# EasyEDA Pro project zxc_411.eprj

# Schematic Schematic1

## Sheets
1 mcu: Create Date: 2024-07-20; Page Name: mcu; Project Name: zxc_411; Schematic Name: Schematic1; Update Date: 2024-08-27; Company: 嘉立创EDA; Page Size: A4; Version: V1.0
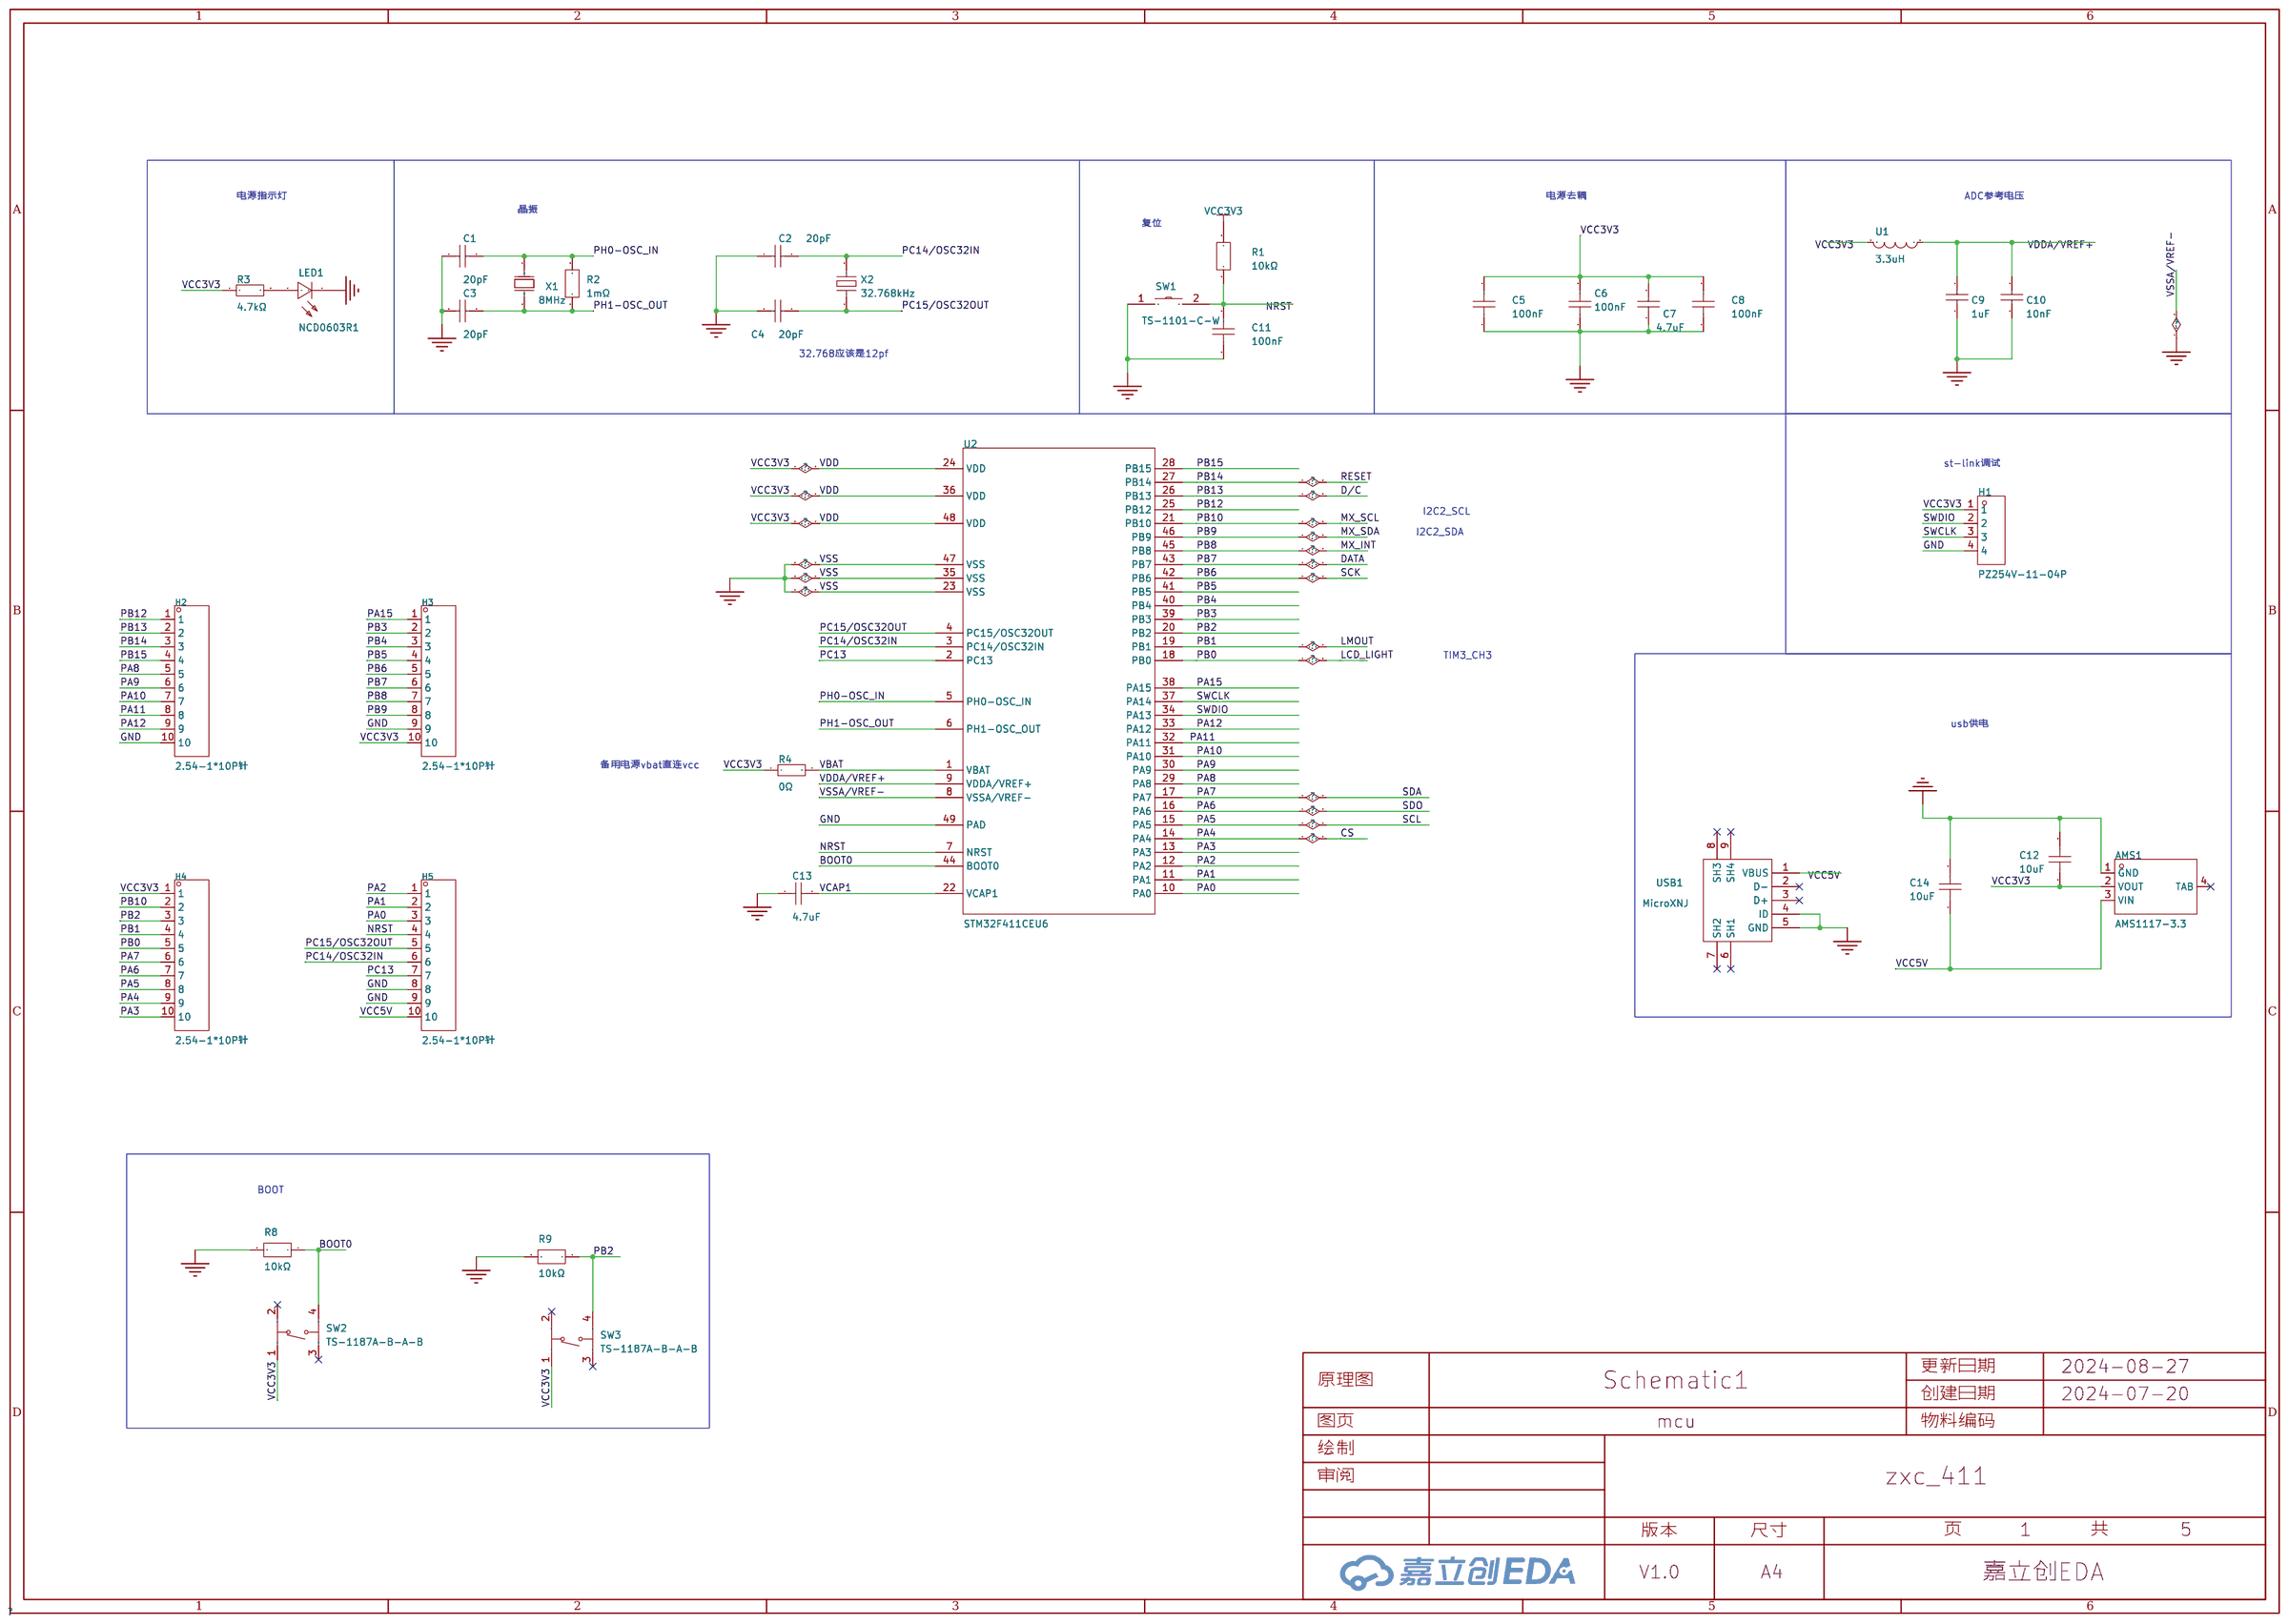
[diagram p0: mcu]
2 lcd: Create Date: 2024-07-21; Page Name: lcd; Update Date: 2024-07-23
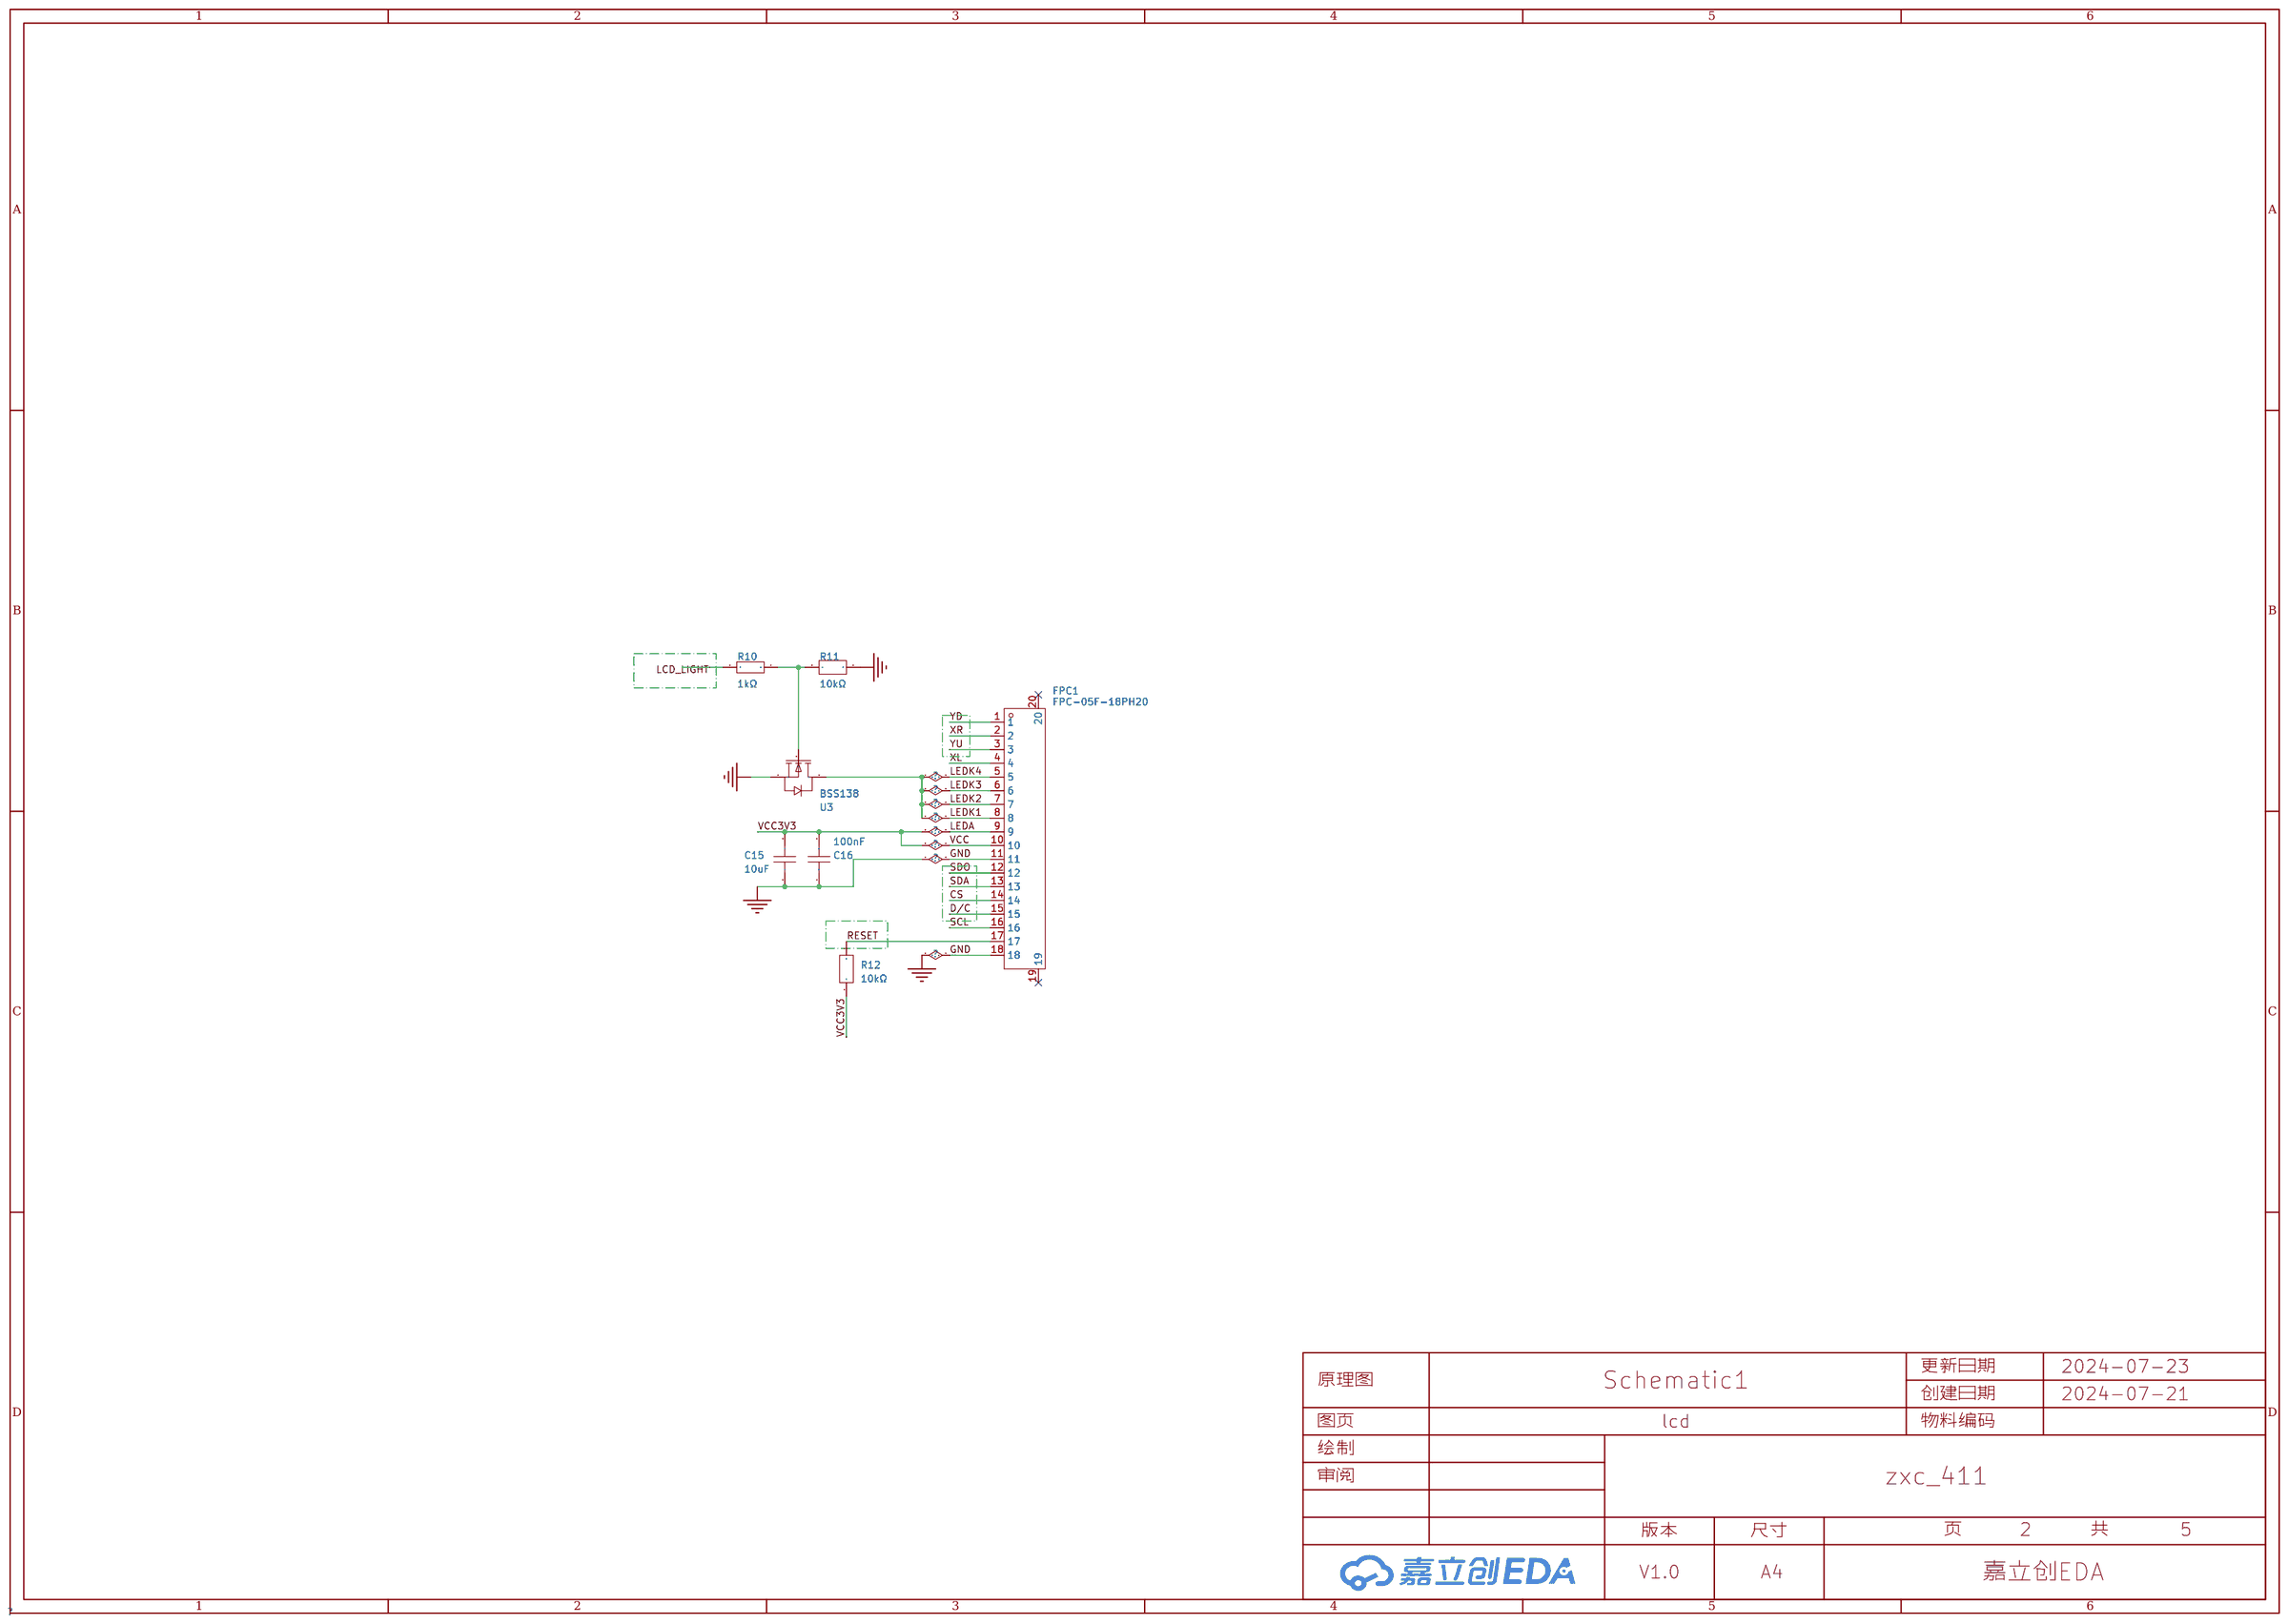
[diagram p1: lcd]
3 htu21d: Create Date: 2024-07-22; Page Name: htu21d; Update Date: 2024-07-23
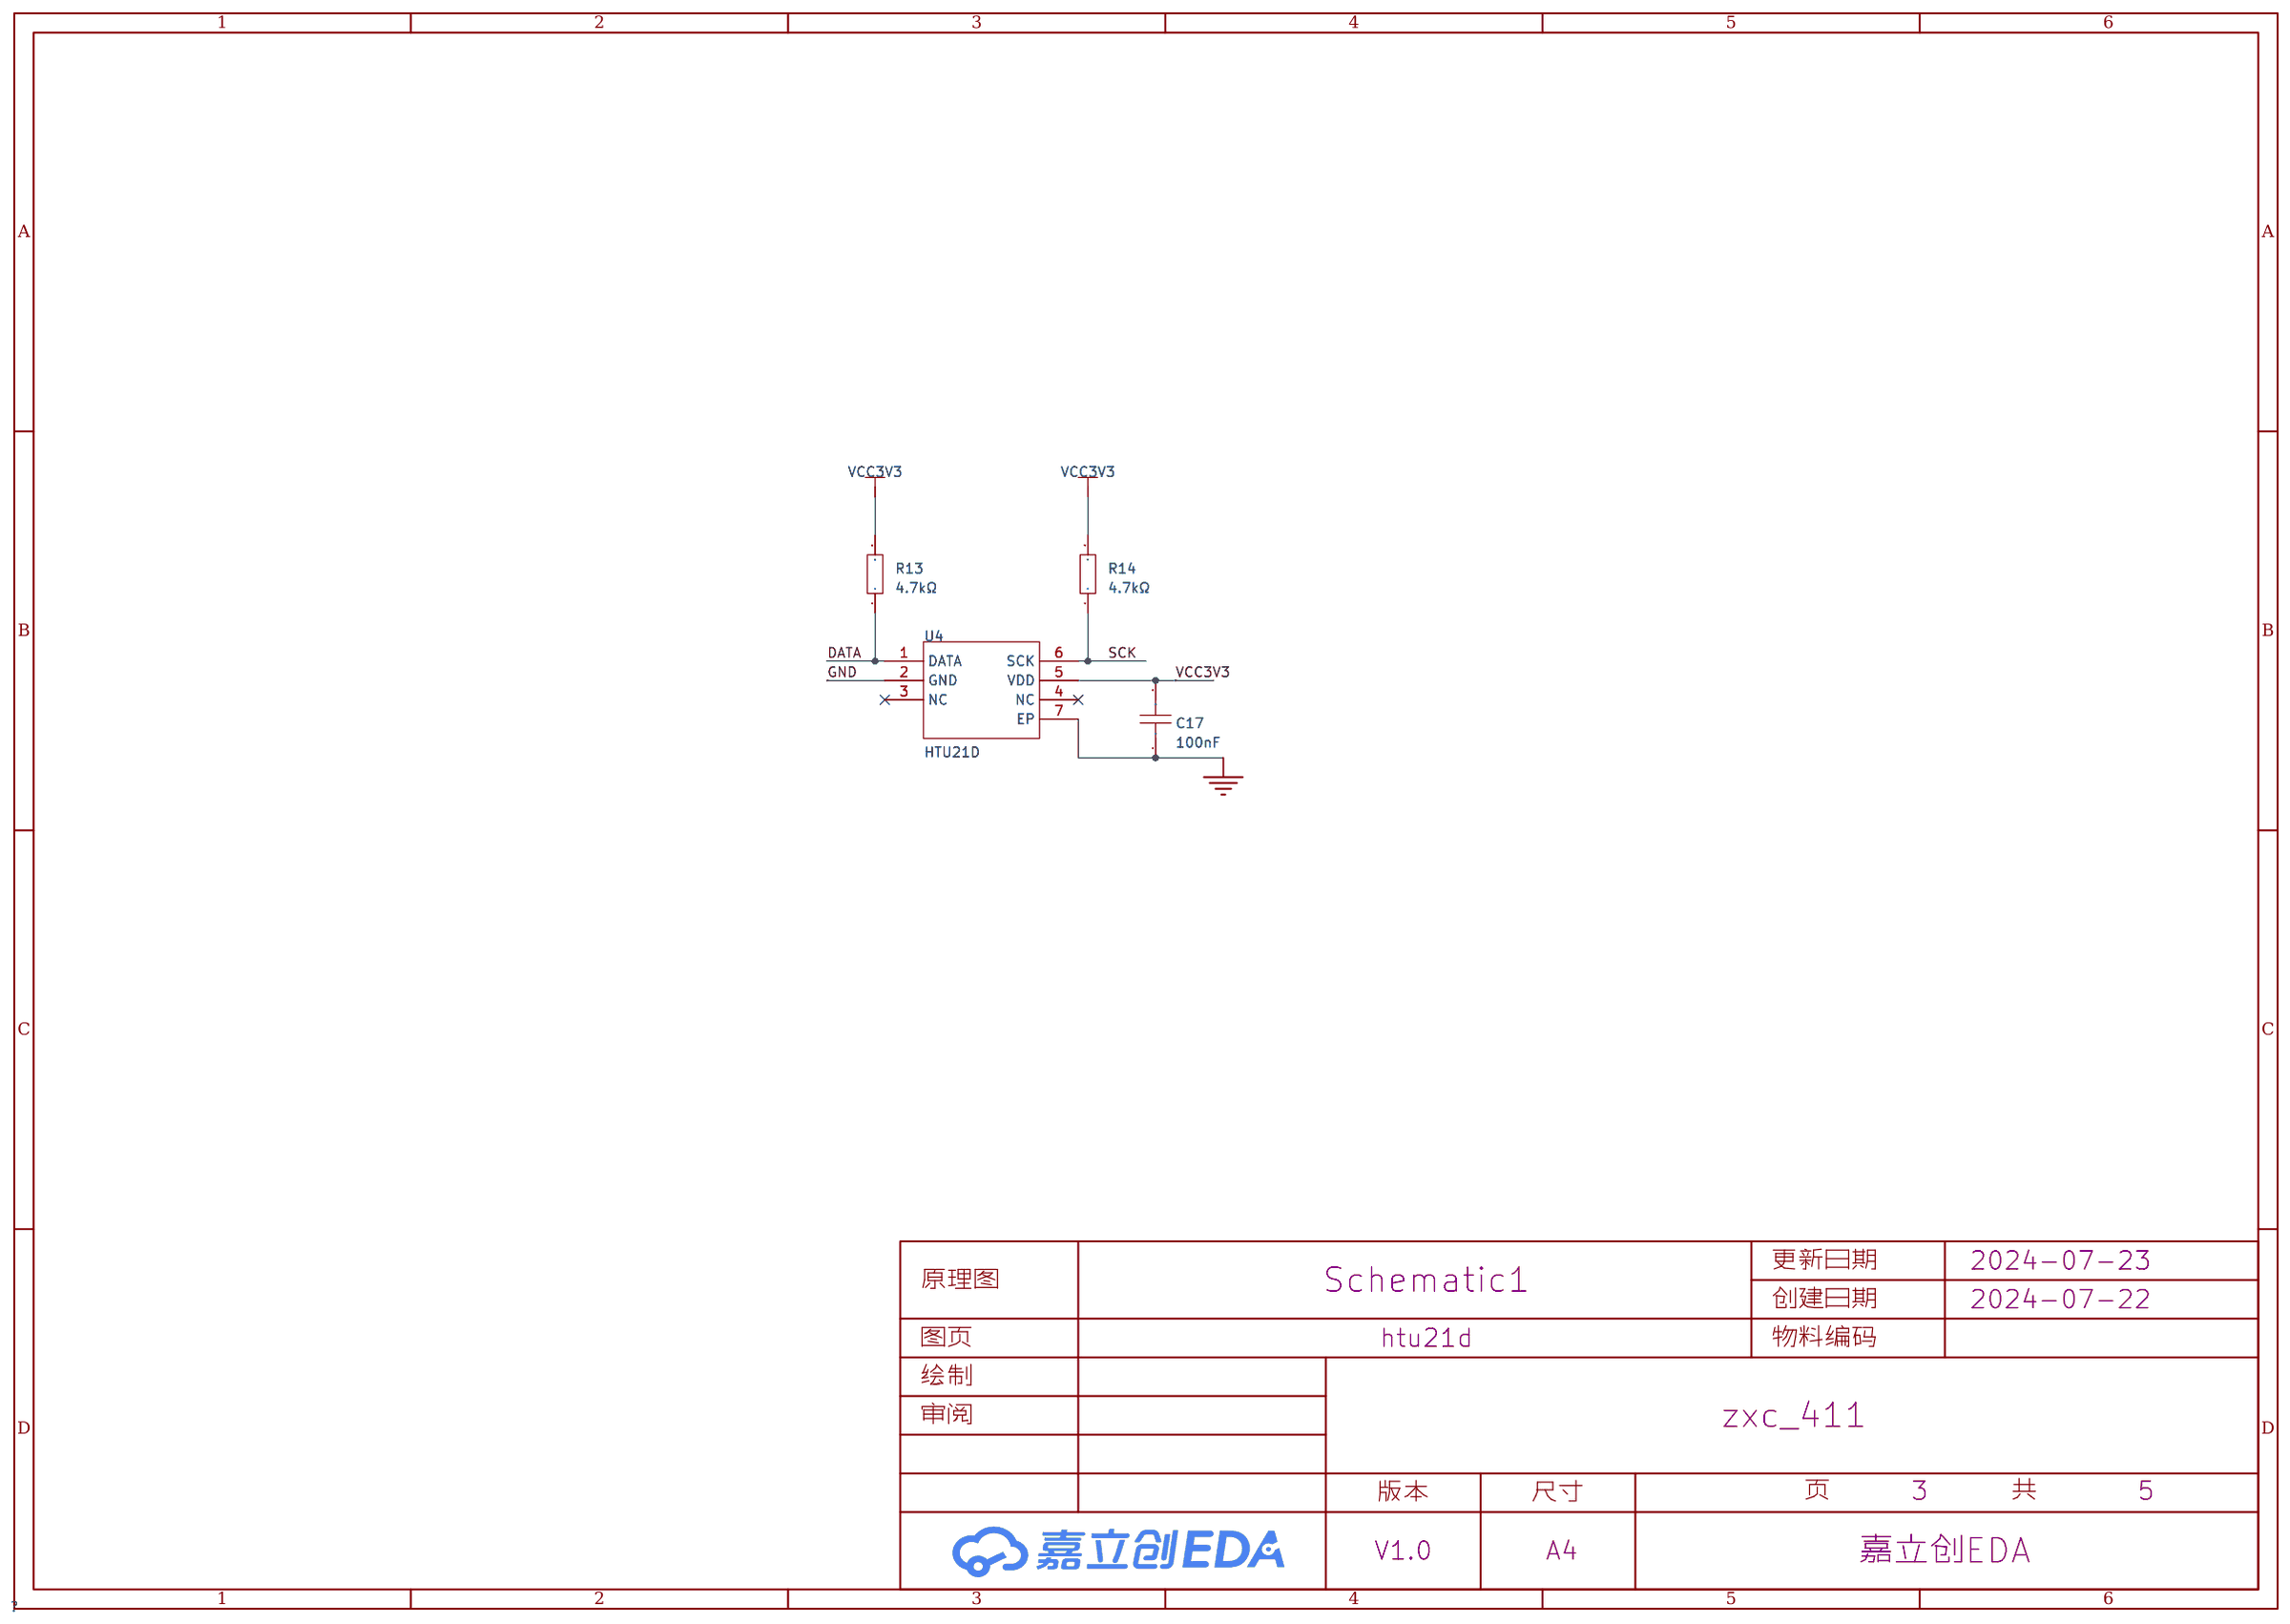
[diagram p2: htu21d]
4 MX: Create Date: 2024-07-22; Page Name: MX; Update Date: 2024-07-23
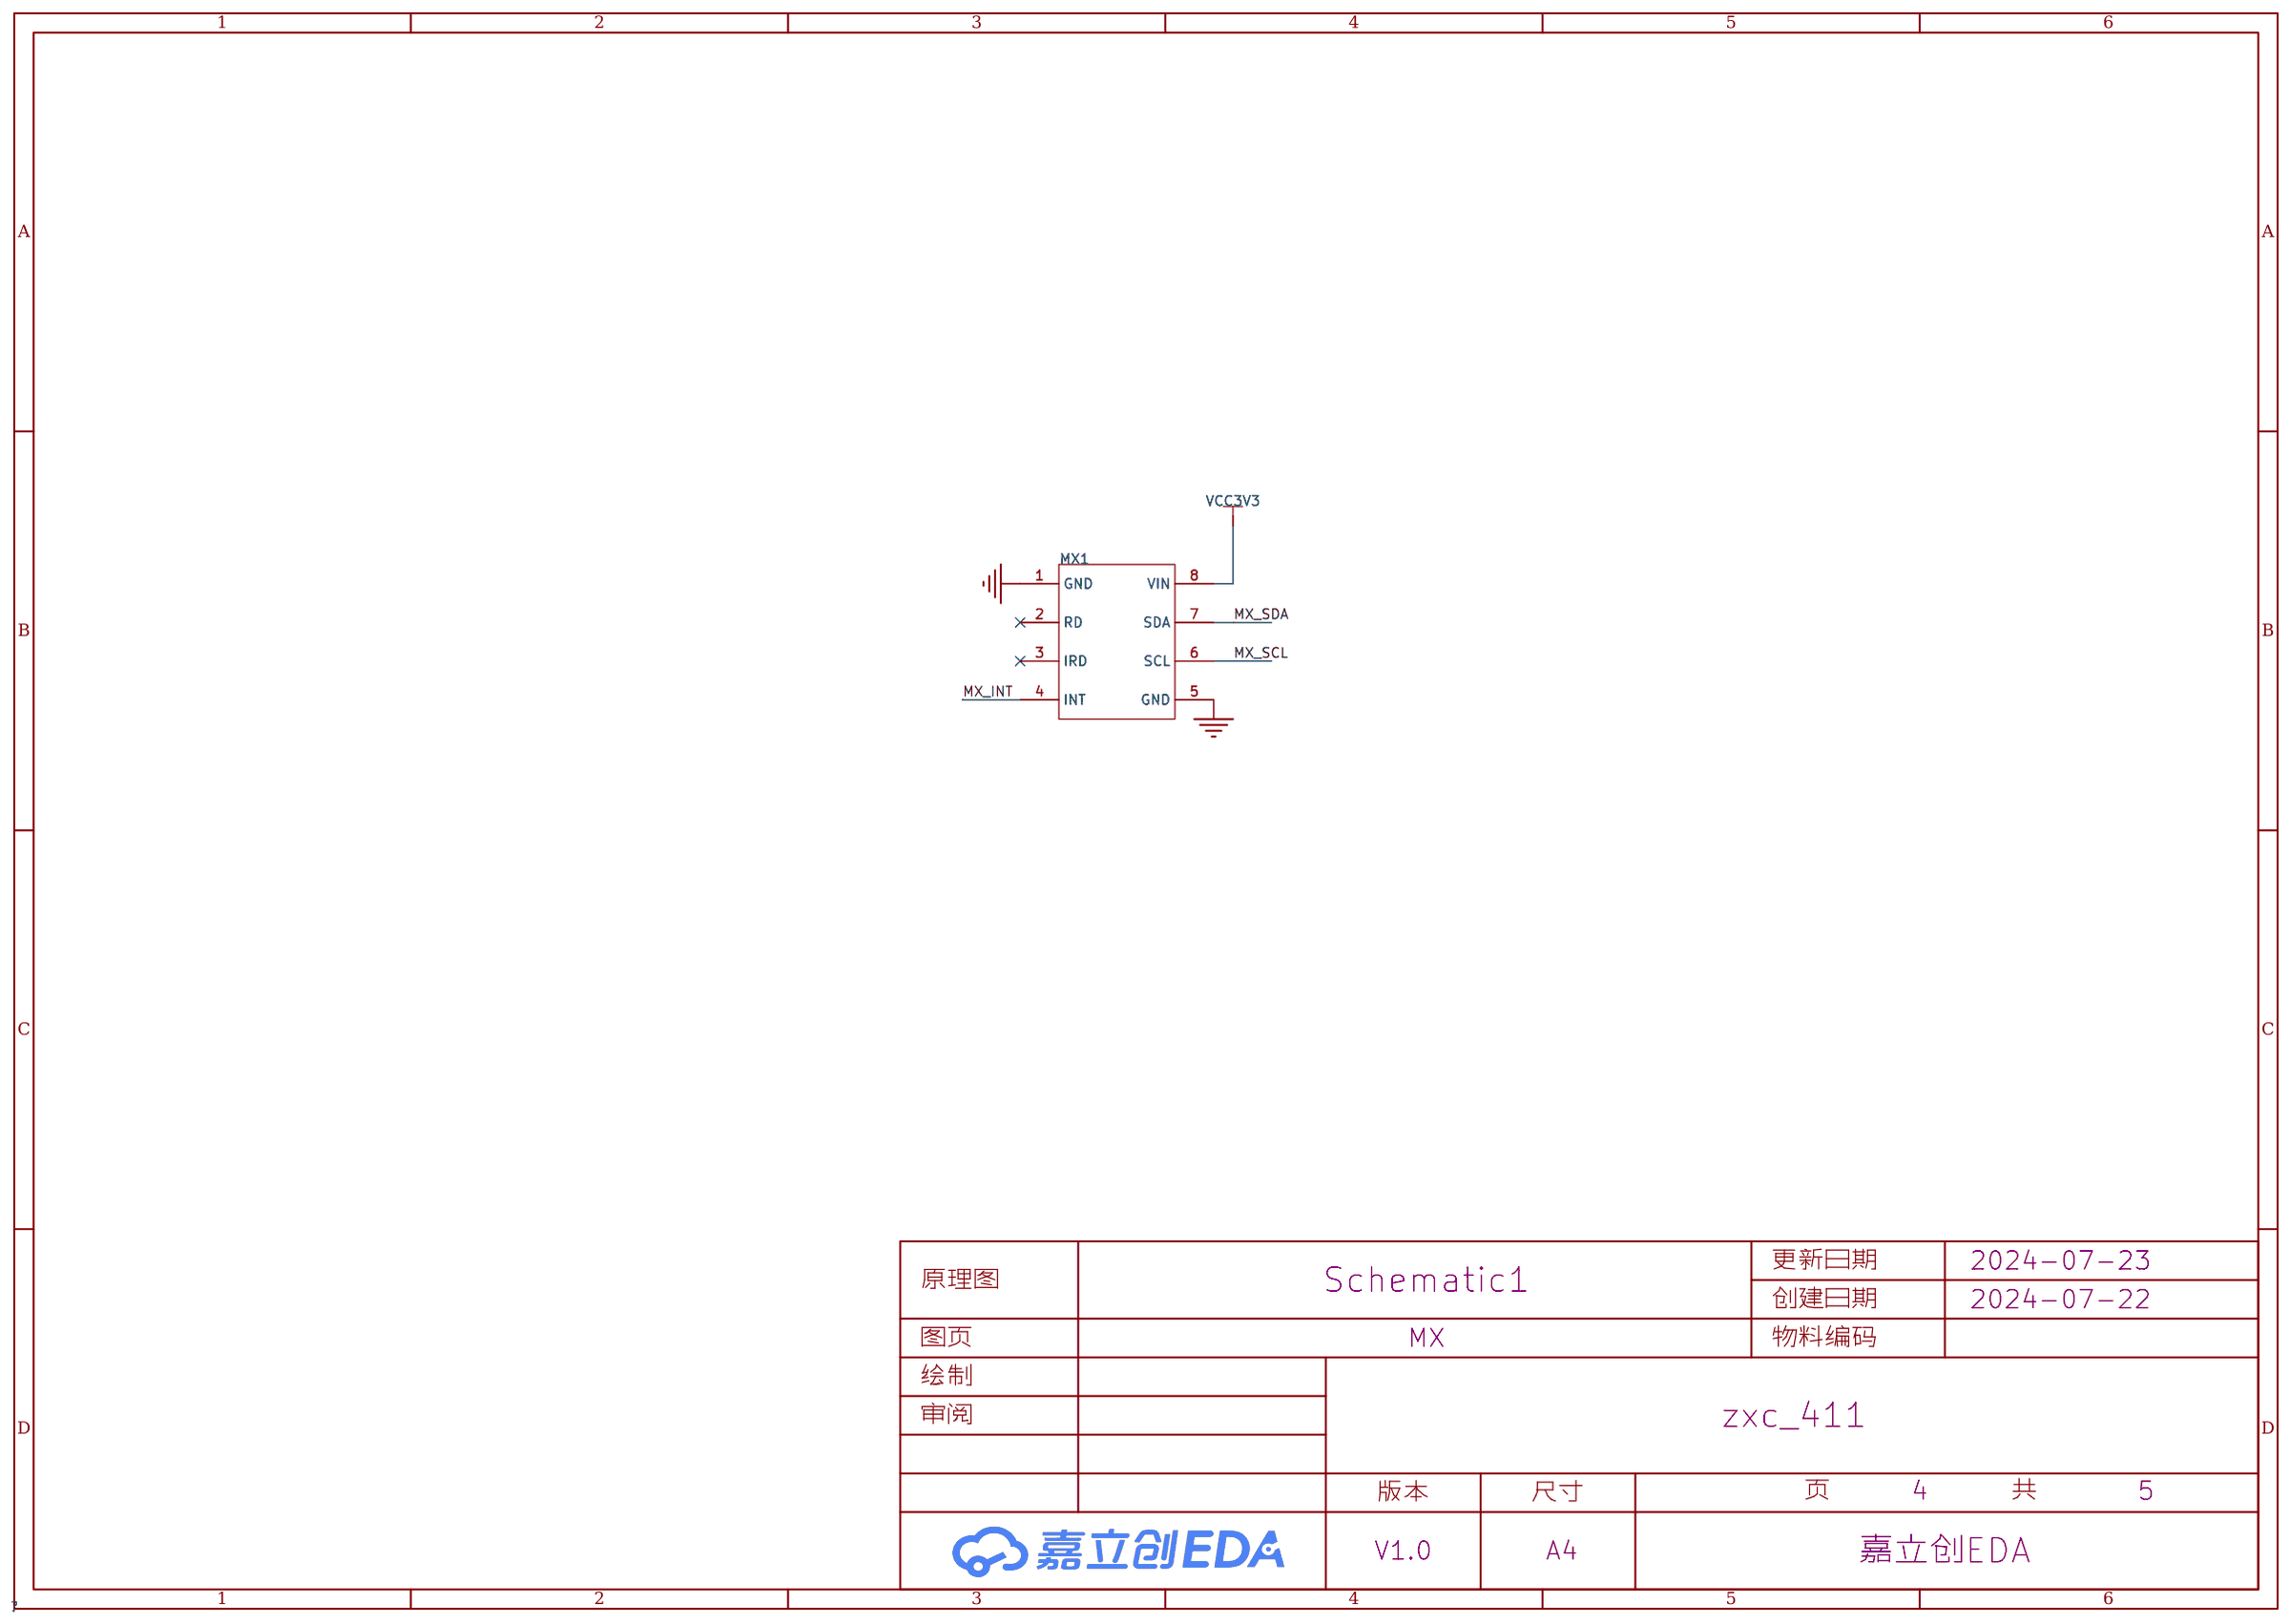
[diagram p3: MX]
5 P5: Create Date: 2024-07-22; Page Name: P5; Update Date: 2024-07-22
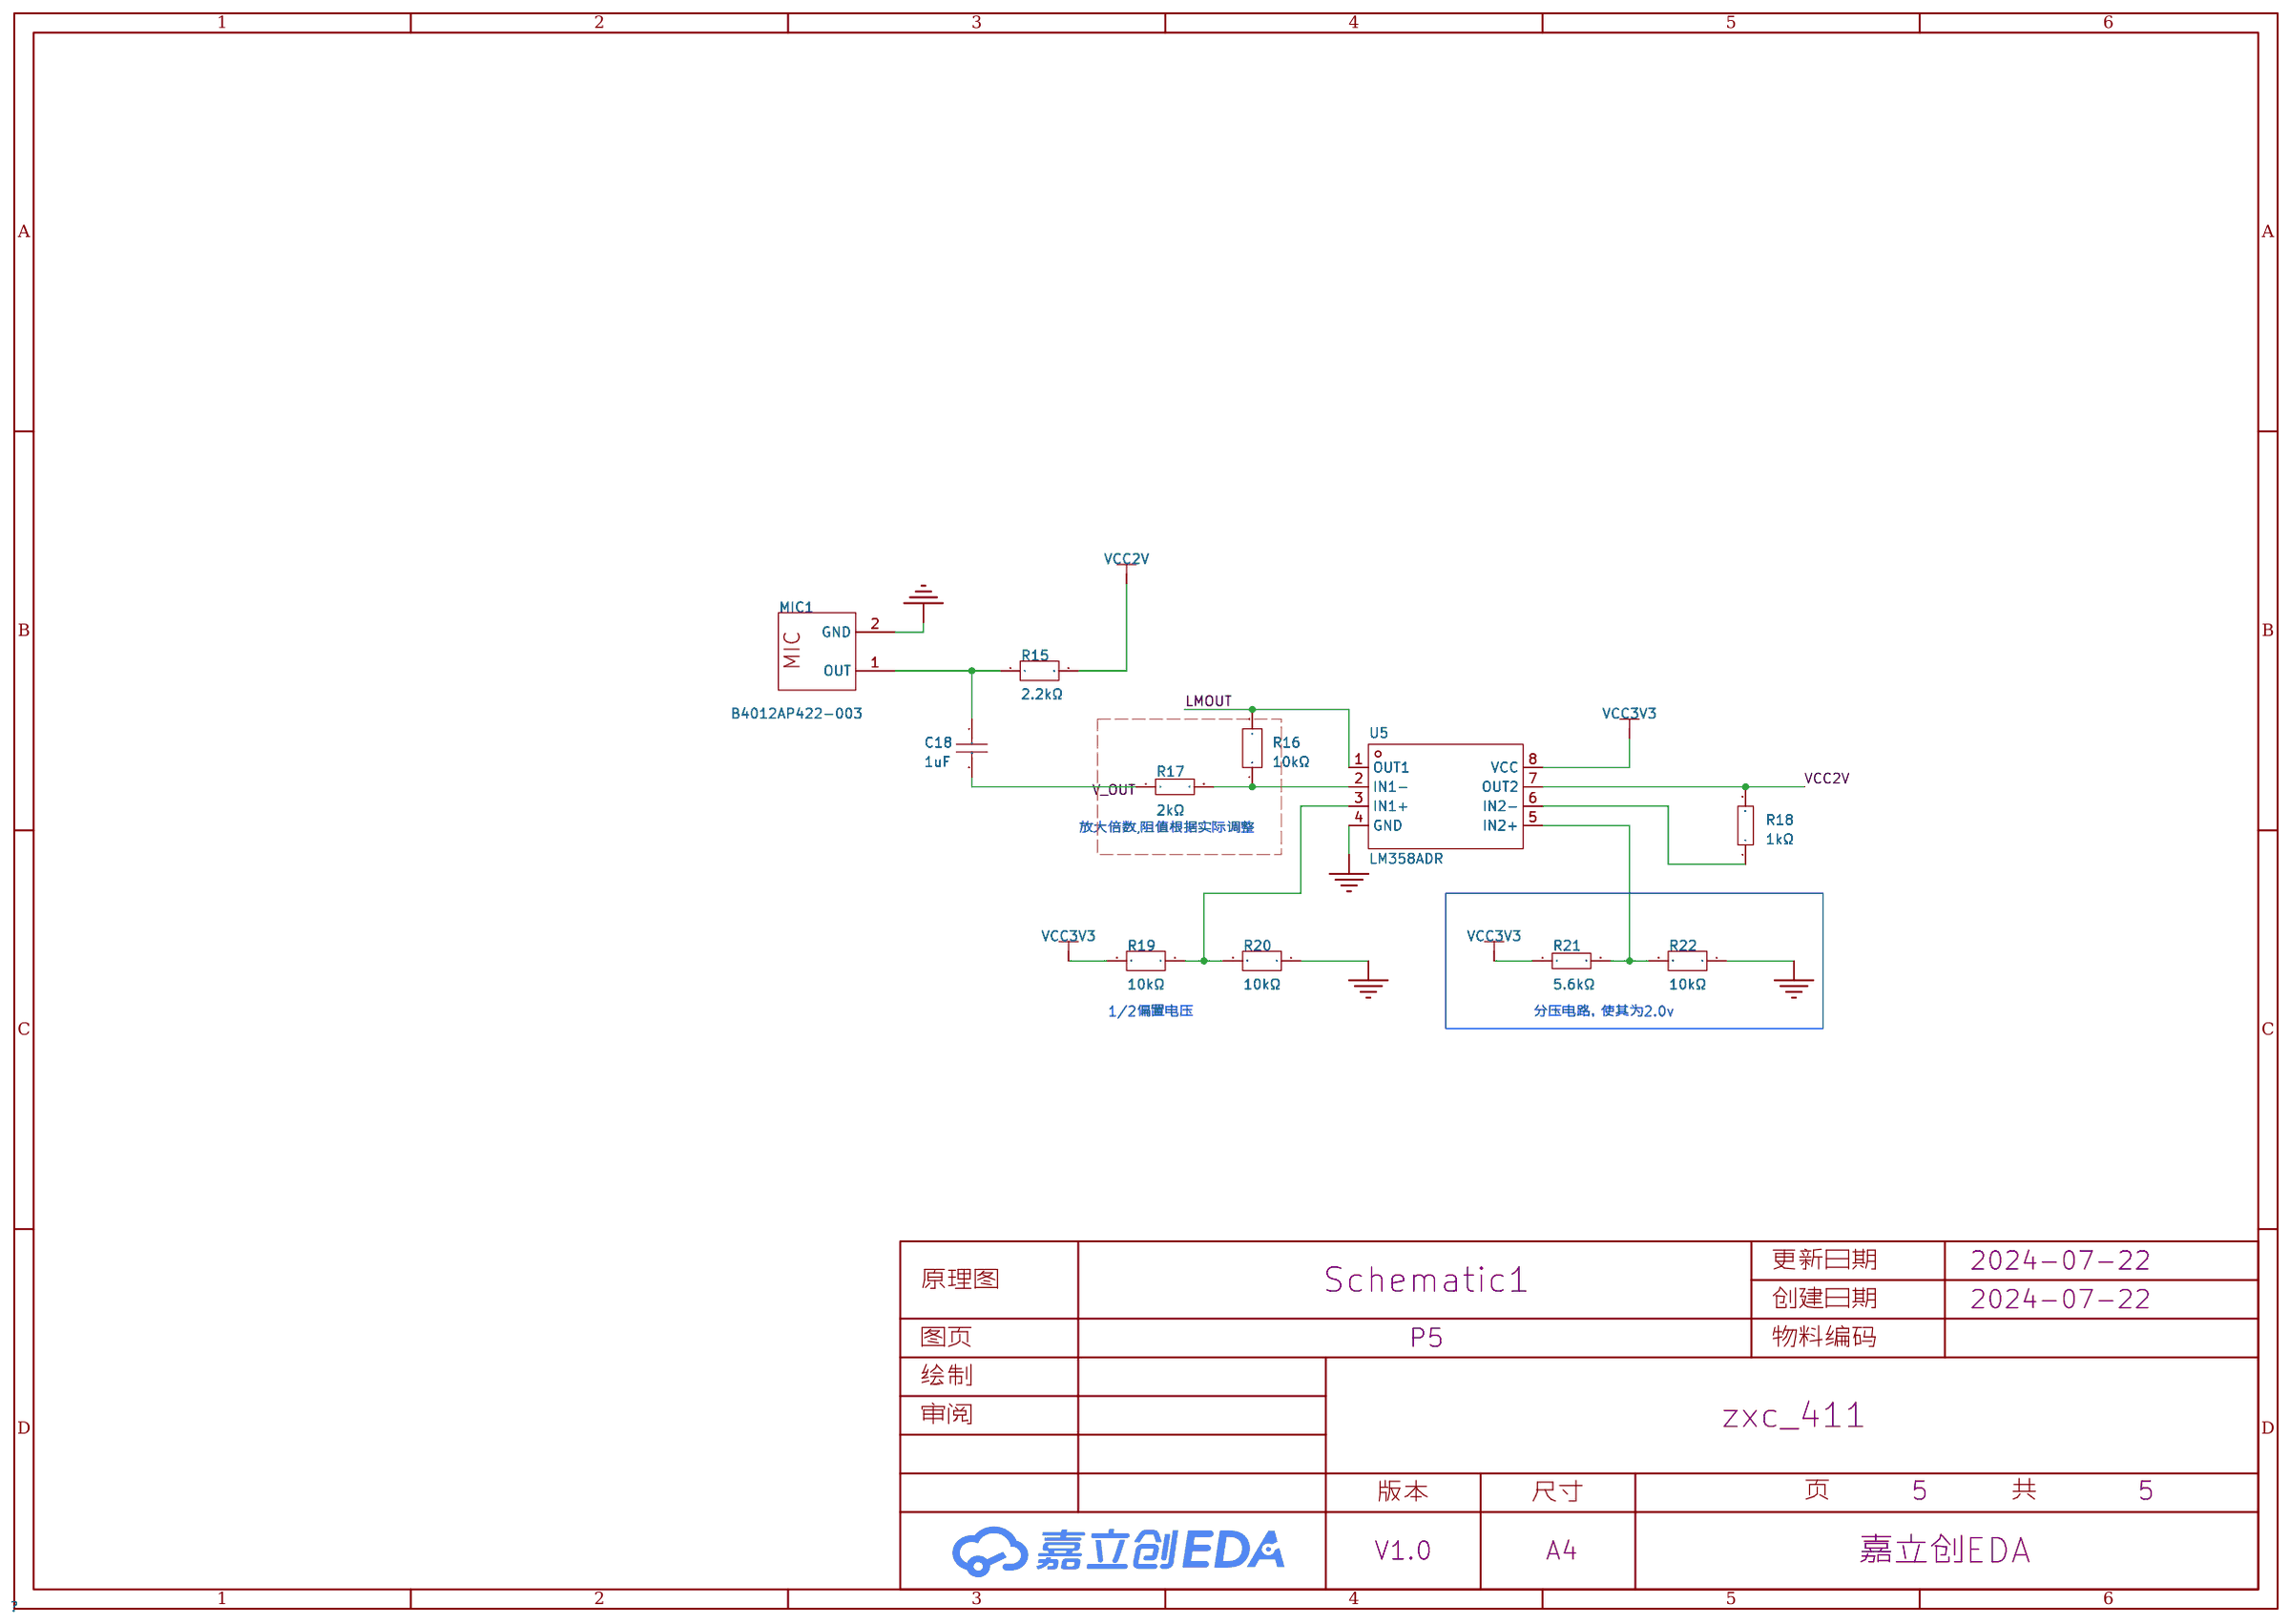
[diagram p4: P5]

## Parts
sheet htu21d
C17  100nF  [C0603]
R13  4.7kΩ  [R0603]
R14  4.7kΩ  [R0603]
U4  HTU21D  [DFN-6_L3.0-W3.0-P1.00-BL-EP]
sheet lcd
C15  10uF  [C0805]
C16  100nF  [C0603]
FPC1  FPC-05F-18PH20  [FPC-SMD_18P-P0.50_FPC-05F-18PH20]
R10  1kΩ  [R0603]
R11  10kΩ  [R0603]
R12  10kΩ  [R0603]
U3  BSS138  [SOT-23-3_L2.9-W1.3-P1.90-LS2.4-BR]
sheet mcu
AMS1  AMS1117-3.3  [SOT-223-3_L6.5-W3.5-P3.05-LS7.0]
C1  20pF  [C0805]
C2  20pF  [C0805]
C3  20pF  [C0805]
C4  20pF  [C0805]
C5  100nF  [C0603]
C6  100nF  [C0603]
C7  4.7uF  [C0603]
C8  100nF  [C0603]
C9  1uF  [C0603]
C10  10nF  [C0603]
C11  100nF  [C0603]
C12  10uF  [C0805]
C13  4.7uF  [C0603]
C14  10uF  [C0805]
H1  PZ254V-11-04P  [HDR-TH_4P-P2.54-V-M]
H2  2.54-1*10P针  [HDR-TH_10P-P2.54-V-M-1]
H3  2.54-1*10P针  [HDR-TH_10P-P2.54-V-M-1]
H4  2.54-1*10P针  [HDR-TH_10P-P2.54-V-M-1]
H5  2.54-1*10P针  [HDR-TH_10P-P2.54-V-M-1]
LED1  NCD0603R1  [LED0603-RD_RED]
R1  10kΩ  [R0603]
R2  1mΩ  [R0603]
R3  4.7kΩ  [R0603]
R4  0Ω  [R0603]
R8  10kΩ  [R0603]
R9  10kΩ  [R0603]
SW1  TS-1101-C-W  [SW-SMD_L6.0-W3.3-LS8.0]
SW2  TS-1187A-B-A-B  [SW-SMD_4P-L5.1-W5.1-P3.70-LS6.5-TL-2]
SW3  TS-1187A-B-A-B  [SW-SMD_4P-L5.1-W5.1-P3.70-LS6.5-TL-2]
U1  3.3uH  [L0603]
U2  STM32F411CEU6  [UFQFPN-48_L7.0-W7.0-P0.50-BL-EP]
USB1  MicroXNJ  [MICRO-USB-SMD_MICROXNJ]
X1  8MHz  [OSC-TH_L10.0-W4.5-P5.00]
X2  32.768kHz  [OSC-SMD_L3.2-W1.5]
sheet MX
MX1  -  [mx30102]
sheet P5
C18  1uF  [C0603]
MIC1  B4012AP422-003  [MIC-TH_BD4.0-P1.40-D0.3-L]
R15  2.2kΩ  [R0603]
R16  10kΩ  [R0603]
R17  2kΩ  [R0603]
R18  1kΩ  [R0603]
R19  10kΩ  [R0603]
R20  10kΩ  [R0603]
R21  5.6kΩ  [R0603]
R22  10kΩ  [R0603]
U5  LM358ADR  [SOIC-8_L5.0-W4.0-P1.27-LS6.0-BL]

## Library data of the parts
C5 C6 C8 C11 C16 C17 = CL10B104KB8NNNC: 容值:100nF;精度:±10%;额定电压:50V;材质(温度系数):X7R;; LCSC Part Name: 100nF ±10% 50V; Supplier Part: C1591; Manufacturer: SAMSUNG(三星); Supplier Footprint: 0603; JLCPCB Part Class: 扩展库; Datasheet: https://atta.szlcsc.com/upload/public/pdf/source/20160218/1457707763339.pdf; Supplier: LCSC; Tolerance: ±10%; Voltage Rated: 50V; Temperature Coefficient: X7R
R3 R13 R14 = RC0603FR-074K7L: 电阻类型:厚膜电阻;阻值:4.7kΩ;精度:±1%;功率:100mW;最大工作电压:75V;温度系数:±100ppm/℃;; LCSC Part Name: 厚膜电阻 4.7kΩ ±1% 100mW; Supplier Part: C99782; Manufacturer: YAGEO(国巨); Supplier Footprint: 0603; JLCPCB Part Class: 扩展库; Datasheet: https://atta.szlcsc.com/upload/public/pdf/source/20180224/C181757_15194369480721363983.pdf; Supplier: LCSC; Type: 厚膜电阻; Tolerance: ±1%; Power(Watts): 100mW; Overload Voltage (Max): 75V; Temperature Coefficient: ±100ppm/℃; Operating Temperature Range: -55℃~+155℃
U4 = HTU21D: 工作电压:1.5~3.6V;湿度精度±2%(SHT20 ±3.5%,SHT21 ±2%);RH响应时间5s(SHT21 8s);功耗2.7uW(SHT21 3.2uW); Supplier Part: C83479; Manufacturer: TE Connectivity(泰科电子); Supplier Footprint: DFN-6-EP(3x3); JLCPCB Part Class: 扩展库; Datasheet: https://atta.szlcsc.com/upload/public/pdf/source/20170217/1487301578909.pdf; Supplier: LCSC
C12 C14 C15 = GRM21BR61C106KE15L: 容值:10uF;精度:±10%;额定电压:16V;材质(温度系数):X5R;; LCSC Part Name: 10uF ±10% 16V; Supplier Part: C77075; Manufacturer: muRata(村田); Supplier Footprint: 0805; JLCPCB Part Class: 扩展库; Datasheet: https://atta.szlcsc.com/upload/public/pdf/source/20200305/C490387_23319AE8C154DEB24C505E6C82A8106A.pdf; Supplier: LCSC; Tolerance: ±10%; Voltage Rated: 16V; Temperature Coefficient: X5R
FPC1 = FPC-05F-18PH20: 锁定特性:翻盖式;触点类型:下接;触点数量:18P;间距:0.5mm;安装类型:卧贴;工作温度范围:-25℃~+85℃;; LCSC Part Name: 间距:0.5mm P数:18P 翻盖式 下接; Supplier Part: C2856802; Manufacturer: XUNPU(讯普); Supplier Footprint: SMD,P=0.5mm,卧贴; JLCPCB Part Class: 扩展库; Datasheet: https://atta.szlcsc.com/upload/public/pdf/source/20210922/C2856802_2A845D1961F33AEC1ED22CECB292335F.pdf; Supplier: LCSC; Locking Feature: 翻盖式; Contact Type: 下接; Number of Contacts: 18P; Pitch: 0.5mm; Mounting Type: 卧贴; FFC, FCB Thickness: 0.3mm; Height Above Board: 2mm; Operating Temperature Range: -25℃~+85℃
R10 R18 = RC0603FR-071KL: 电阻类型:厚膜电阻;阻值:1kΩ;精度:±1%;功率:100mW;最大工作电压:75V;温度系数:±100ppm/℃;; LCSC Part Name: 厚膜电阻 1kΩ ±1% 100mW; Supplier Part: C22548; Manufacturer: YAGEO(国巨); Supplier Footprint: 0603; JLCPCB Part Class: 扩展库; Datasheet: https://atta.szlcsc.com/upload/public/pdf/source/20180316/70C0E2BDAE7FCC62C531A5A58D202EE1.pdf; Supplier: LCSC; Type: 厚膜电阻; Tolerance: ±1%; Power(Watts): 100mW; Overload Voltage (Max): 75V; Temperature Coefficient: ±100ppm/℃; Operating Temperature Range: -55℃~+155℃
R1 R8 R9 R11 R12 R16 R19 R20 R22 = SC0603F1002F2BNRH: 阻值:10kΩ;精度:±1%;功率:-;温度系数:±100ppm/℃;; LCSC Part Name: 10kΩ ±1%; Supplier Part: C3152123; Manufacturer: Sunway(信维通信); Supplier Footprint: 0603; JLCPCB Part Class: 扩展库; Datasheet: https://atta.szlcsc.com/upload/public/pdf/source/20220728/FFCE43BB6DF8FA16AEE331F0F4B289DE.pdf; Supplier: LCSC; Tolerance: ±1%; Temperature Coefficient: ±100ppm/℃
U3 = BSS138_C7420339: 类型:1个N沟道;漏源电压(Vdss):50V;连续漏极电流(Id):340mA;功率(Pd):350mW;导通电阻(RDS(on)@Vgs,Id):2.5Ω@10V,0.34A;阈值电压(Vgs(th)@Id):1.6V@250uA;; LCSC Part Name: 1个N沟道 耐压:50V 电流:340mA; Supplier Part: C7420339; Manufacturer: 宏迦橙; Supplier Footprint: SOT-23; JLCPCB Part Class: 扩展库; Datasheet: https://atta.szlcsc.com/upload/public/pdf/source/20230828/FA091145E476A230936B8E03226CDB87.pdf; Supplier: LCSC; Type: 1个N沟道; Drain Source Voltage (Vdss): 50V; Continuous Drain Current (Id): 340mA; Power Dissipation (Pd): 350mW; Drain Source On Resistance (RDS(on)@Vgs,Id): 2.5Ω@10V,0.34A; Gate Threshold Voltage (Vgs(th)@Id): 1.6V@250uA; Total Gate Charge (Qg@Vgs): 1.7nC@10V; Input Capacitance (Ciss@Vds): 17.5pF@25V; Reverse Transfer Capacitance (Crss@Vds): 6.5pF@25V; Operating Temperature: -55℃~+150℃
AMS1 = AMS1117-3.3_C5250992: 输出类型：固定 输出极性：正 最大输入电压：18V 输出电压：3.3V 输出电流：1A 电源纹波抑制比(PSRR)：60dB@(120Hz)。当前应用较多领域：三端稳压器，机顶盒; Supplier Part: C5250992; Manufacturer: TWGMC(台湾迪嘉); Supplier Footprint: SOT-223-3L; JLCPCB Part Class: 扩展库; Datasheet: https://atta.szlcsc.com/upload/public/pdf/source/20221109/A58A92B07670E85D28928AE371260E8D.pdf; Supplier: LCSC
C1-C4 = CC0805JRNPO9BN200: 容值:20pF;精度:±5%;额定电压:50V;材质(温度系数):NP0;; LCSC Part Name: 20pF ±5% 50V; Supplier Part: C105173; Manufacturer: YAGEO(国巨); Supplier Footprint: 0805; JLCPCB Part Class: 扩展库; Datasheet: https://atta.szlcsc.com/upload/public/pdf/source/20181008/C309499_21CC21451B82C39E3D92150FD6B30293.pdf; Supplier: LCSC; Tolerance: ±5%; Voltage Rated: 50V; Temperature Coefficient: NP0
C7 C13 = 0603X475K160NT: 容值:4.7uF;精度:±10%;额定电压:16V;材质(温度系数):X5R;; LCSC Part Name: 4.7uF ±10% 16V; Supplier Part: C99229; Manufacturer: FH(风华); Supplier Footprint: 0603; JLCPCB Part Class: 扩展库; Datasheet: https://atta.szlcsc.com/upload/public/pdf/source/20200305/C486355_26A10D38EF8C2A5C37091D0039909270.pdf; Supplier: LCSC; Tolerance: ±10%; Voltage Rated: 16V; Temperature Coefficient: X5R
C9 C18 = 0603B105K250NT: 容值:1uF;精度:±10%;额定电压:25V;材质(温度系数):X7R;; LCSC Part Name: 1uF ±10% 25V; Supplier Part: C59302; Manufacturer: FH(风华); Supplier Footprint: 0603; JLCPCB Part Class: 扩展库; Datasheet: https://atta.szlcsc.com/upload/public/pdf/source/20200305/C486355_26A10D38EF8C2A5C37091D0039909270.pdf; Supplier: LCSC; Tolerance: ±10%; Voltage Rated: 25V; Temperature Coefficient: X7R
C10 = 0603B103K500NT: 容值:10nF;精度:±10%;额定电压:50V;材质(温度系数):X7R;; LCSC Part Name: 10nF ±10% 50V; Supplier Part: C57112; Manufacturer: FH(风华); Supplier Footprint: 0603; JLCPCB Part Class: 基础库; Datasheet: https://atta.szlcsc.com/upload/public/pdf/source/20200305/C486355_26A10D38EF8C2A5C37091D0039909270.pdf; Supplier: LCSC; Tolerance: ±10%; Voltage Rated: 50V; Temperature Coefficient: X7R
H1 = PZ254V-11-04P: 插针结构:1x4P;间距:2.54mm;行距:-;圆针/方针:方针;安装类型:直插;排数:单排;总PIN位数:4P;额定电流:3A;额定电压:250V;配合针长度:6mm;塑高:2.5mm;端接针长度:3mm;触头材质:-;工作温度范围:-40℃~+105℃;颜色:黑色;; LCSC Part Name: 间距:2.54mm 1x4P 直插 方针; Supplier Part: C2691448; Manufacturer: XFCN(兴飞); Supplier Footprint: 插件,P=2.54mm; JLCPCB Part Class: 扩展库; Datasheet: https://atta.szlcsc.com/upload/public/pdf/source/20200309/C492403_F9F19131791D08044AD4F84F8E751A34.pdf; Supplier: LCSC; Pin Structure: 1x4P; Pitch: 2.54mm; Circluar Pins/Square Pins: 方针; Mounting Type: 直插; Number of Rows: 单排; Number of Pins: 4P; Current Rating (Max): 3A; Voltage Rating (Max): 250V; Length of Mating Pin: 6mm; Insulation Height: 2.5mm; Length of End Connection Pin: 3mm; Operating Temperature Range: -40℃~+105℃; Color: 黑色
H2-H5 = 2.54-1*10P针: 插针结构:1x10P;间距:2.54mm;行距:-;圆针/方针:方针;安装类型:直插;排数:单排;总PIN位数:10P;额定电流:3A;额定电压:-;配合针长度:-;塑高:-;端接针长度:-;触头材质:-;触头镀层:-;工作温度范围:-40℃~+105℃;颜色:黑色;; LCSC Part Name: 间距:2.54mm 1x10P 直插 方针; Supplier Part: C57369; Manufacturer: BOOMELE(博穆精密); Supplier Footprint: 插件,P=2.54mm; JLCPCB Part Class: 扩展库; Datasheet: https://atta.szlcsc.com/upload/public/pdf/source/20151109/1457707572883.pdf; Supplier: LCSC; Pin Structure: 1x10P; Pitch: 2.54mm; Circluar Pins/Square Pins: 方针; Mounting Type: 直插; Number of Rows: 单排; Number of Pins: 10P; Current Rating (Max): 3A; Operating Temperature Range: -40℃~+105℃; Color: 黑色
LED1 = NCD0603R1_C84263: 灯头类型:-;发光颜色:红色;正向电压(VF):1.6V~2.6V;功率:65mW;正向电流:20mA;主波长:615nm~630nm;二极管配置:独立二极管;透镜颜色:无色透明透镜;色温:-;发光强度:80mcd~220mcd;发光角度:130°;载带方式:-;工作温度:-30℃~+85℃;; Supplier Part: C84263; Manufacturer: 国星光电; Supplier Footprint: 0603; JLCPCB Part Class: 扩展库; Datasheet: https://atta.szlcsc.com/upload/public/pdf/source/20200820/C84263_DABC6A75E58F576973B407FDBA283D60.pdf; Supplier: LCSC; Emitted Color: 红色; Forward Voltage (VF): 1.6V~2.6V; Power Dissipation: 65mW; Forward Current: 20mA; Dominant Wavelength: 615nm~630nm; Diode Configuration: 独立二极管; Lens Color: 无色透明透镜; Luminous Intensity: 80mcd~220mcd; Viewing Angle: 130°; Operating Temperature: -30℃~+85℃
R2 = MST0603R0010FSM: 电阻类型:-;阻值:1mΩ;精度:±1%;功率:500mW;温度系数:±50ppm/℃;; LCSC Part Name: 1mΩ ±1% 500mW; Supplier Part: C6685497; Manufacturer: EATON(伊顿); Supplier Footprint: 0603; JLCPCB Part Class: 扩展库; Datasheet: https://atta.szlcsc.com/upload/public/pdf/source/20240122/4D085FF489531ECF5336297C7BED40A7.pdf; Supplier: LCSC; Tolerance: ±1%; Power(Watts): 500mW; Temperature Coefficient: ±50ppm/℃; Operating Temperature Range: -55℃~+155℃
R4 = 0603WAF0000T5E: 电阻类型:厚膜电阻;阻值:0Ω;精度:±1%;功率:100mW;最大工作电压:75V;; LCSC Part Name: 0Ω ±1% 100mW 厚膜电阻; Supplier Part: C21189; Manufacturer: UNI-ROYAL(厚声); Supplier Footprint: 0603; JLCPCB Part Class: 基础库; Datasheet: https://atta.szlcsc.com/upload/public/pdf/source/20200306/C422600_1E6D84923E4A46A82E41ADD87F860B5C.pdf; Supplier: LCSC; Type: 厚膜电阻; Tolerance: ±1%; Power(Watts): 100mW; Overload Voltage (Max): 75V; Operating Temperature Range: -55℃~+155℃
SW1 = TS-1101-C-W: 电路结构:单刀单掷;按钮形状:矩形按钮;作用力:260gf;安装方式:立贴;开关长度:6mm;开关宽度:3.6mm;开关高度:2.5mm;带支架:不带;触点电流:50mA;额定电压(AC):-;额定电压(DC):12V;额定功率:-;绝缘电阻:-;带灯:无;机械寿命:5万次;; LCSC Part Name: 6*3.6*2.5mm 立贴 轻触开关; Supplier Part: C318938; Manufacturer: XKB Connectivity(中国星坤); Supplier Footprint: SMD; JLCPCB Part Class: 扩展库; Datasheet: https://atta.szlcsc.com/upload/public/pdf/source/20200227/C318938_C2E53B1EEDE37D980A33616AC086DE53.pdf; Supplier: LCSC; Circuit: 单刀单掷; Actuator Style: 矩形按钮; Operating Force: 260gf; Mounting Style: 立贴; Switch Length: 6mm; Switch Width: 3.6mm; Switch Height: 2.5mm; Strike Gundam: 不带; Contact Current: 50mA; Voltage Rating (DC): 12V; Actuator/Cap Color: 白色带淡绿; With Lamp: 无; Mechanical Life: 5万次; Operating Temperature: -30℃~+85℃
SW2 SW3 = TS-1187A-B-A-B: 电路结构:单刀单掷;按钮形状:圆形按钮;作用力:160gf;安装方式:立贴;开关长度:5.1mm;开关宽度:5.1mm;开关高度:1.5mm;带支架:不带;触点电流:50mA;额定电压(DC):12V;绝缘电阻:-;带灯:无;机械寿命:10万次;; LCSC Part Name: 5.1*5.1*1.5mm 立贴 轻触开关; Supplier Part: C318884; Manufacturer: XKB Connectivity(中国星坤); Supplier Footprint: SMD; JLCPCB Part Class: 基础库; Datasheet: https://atta.szlcsc.com/upload/public/pdf/source/20200227/C318890_053E50208A88A7BA1965D8746000774E.pdf; Supplier: LCSC; Circuit: 单刀单掷; Actuator Style: 圆形按钮; Operating Force: 160gf; Mounting Style: 立贴; Switch Length: 5.1mm; Switch Width: 5.1mm; Switch Height: 1.5mm; Strike Gundam: 不带; Contact Current: 50mA; Voltage Rating (DC): 12V; Actuator/Cap Color: 金色; With Lamp: 无; Mechanical Life: 10万次; Operating Temperature: -30℃~+85℃
U1 = EBLS1608-3R3K: 电感值:3.3uH;精度:±10%;额定电流:15mA;饱和电流(Isat):-;直流电阻(DCR):1.55Ω;; LCSC Part Name: 3.3uH ±10%; Supplier Part: C963792; Manufacturer: HYHONGYEX(宏业); Supplier Footprint: 0603; JLCPCB Part Class: 扩展库; Datasheet: https://atta.szlcsc.com/upload/public/pdf/source/20230519/68C0B22DCE7074F96FDCDA159F00FC65.pdf; Supplier: LCSC; Tolerance: ±10%; Rated Current: 15mA; DC Resistance (DCR): 1.55Ω; Q @ Freq: 35@10MHz; Frequency - Self Resonant: 40MHz
U2 = STM32F411CEU6: CPU内核:CM4;程序存储容量:512KB;RAM总容量:128KB;GPIO端口数量:36;工作电压范围:1.7V~3.6V;CPU最大主频:100MHz;程序存储器类型:FLASH;; Supplier Part: C60420; Manufacturer: ST(意法半导体); Supplier Footprint: UFQFPN-48(7x7); JLCPCB Part Class: 扩展库; Datasheet: https://atta.szlcsc.com/upload/public/pdf/source/20151026/1457707507170.pdf; Supplier: LCSC; CPU Core: CM4; Program Storage Size: 512KB; RAM Size: 128KB; GPIO Ports Number: 36; Operating Voltage Range: 1.7V~3.6V; CPU Maximum Speed: 100MHz; Program Memory Type: FLASH; Operating Temperature Range: -40℃~+85℃; ADC (Bit): 12bit; Universal Serial Bus: 有; Peripheral/Function: DMA；PWM; Watchdog: 有; Infrared Data Association: 有; Low-Voltage Detect: 有; Secure Digital Input and Output: 有; Direct Memory Access: 有; Internal Oscillator: 有
USB1 = MicroXNJ: 连接器类型:Micro-B;标准:USB 2.0;公母:母;安装方式:卧贴;触点数量:5P;端口数量:1;额定电流 - 电源:1A;工作温度范围:-20℃~+85℃;; LCSC Part Name: Micro-B 母 卧贴; Supplier Part: C404969; Manufacturer: SHOU HAN(首韩); Supplier Footprint: SMD; JLCPCB Part Class: 扩展库; Datasheet: https://atta.szlcsc.com/upload/public/pdf/source/20220415/2494EDFF499AF6F852F7C820374B6AF3.pdf; Supplier: LCSC; Connector Type: Micro-B; Standard: USB 2.0; Gender: 母; Mounting Style: 卧贴; Number of Contacts: 5P; Number of Ports: 1; Current Rating - Power (Max): 1A; Operating Temperature Range: -20℃~+85℃
X1 = X49SD8MSD2SC: 晶振类型:直插晶振;频率:8MHz;常温频差:±20ppm;外接负载电容:20pF;频率稳定度(全温):±30ppm;; LCSC Part Name: 8MHz ±20ppm 20pF; Supplier Part: C21263; Manufacturer: YXC(扬兴晶振); Supplier Footprint: HC-49S; JLCPCB Part Class: 扩展库; Datasheet: https://atta.szlcsc.com/upload/public/pdf/source/20240329/977D7F2434F98B2BE33270BB9FF3D86D.pdf; Supplier: LCSC; Crystal Type: 直插晶振; Normal temperature Frequency Tolerance: ±20ppm; External load capacitor: 20pF; Frequency Stability(Full temperature range): ±30ppm; Operating Temperature: -20℃~+70℃
X2 = X321532768KGD2SI: 晶振类型:贴片晶振;频率:32.768kHz;常温频差:±20ppm;外接负载电容:12.5pF;频率稳定度(全温):-;; LCSC Part Name: 32.768kHz ±20ppm 12.5pF; Supplier Part: C620155; Manufacturer: YXC(扬兴晶振); Supplier Footprint: SMD3215-2P; JLCPCB Part Class: 扩展库; Datasheet: https://atta.szlcsc.com/upload/public/pdf/source/20240329/3A7650FD985DD0DE85694D3785AB4916.pdf; Supplier: LCSC; Crystal Type: 贴片晶振; Normal temperature Frequency Tolerance: ±20ppm; External load capacitor: 12.5pF; Operating Temperature: -40℃~+85℃
MX1 = mx30102
MIC1 = B4012AP422-003: LCSC Part Name: 驻极体电容φ4.0*1.2mm 1.1V-10V 灵敏度-42dB 停产; Supplier Part: C233791; Manufacturer: Goertek(歌尔); Supplier Footprint: 插件,D=4mm; JLCPCB Part Class: 扩展库; Datasheet: https://atta.szlcsc.com/upload/public/pdf/source/20180813/C233791_EB931036CBE94BDAE55CF8920DD0A876.pdf; Supplier: LCSC
R15 = FRC0603J222 TS: 电阻类型:厚膜电阻;阻值:2.2kΩ;精度:±5%;功率:100mW;最大工作电压:75V;温度系数:±100ppm/℃;; LCSC Part Name: 2.2kΩ ±5% 100mW 厚膜电阻; Supplier Part: C2907117; Manufacturer: FOJAN(富捷); Supplier Footprint: 0603; JLCPCB Part Class: 扩展库; Datasheet: https://atta.szlcsc.com/upload/public/pdf/source/20211221/925EC7D7225764EE0046F22065062C87.pdf; Supplier: LCSC; Type: 厚膜电阻; Tolerance: ±5%; Power(Watts): 100mW; Overload Voltage (Max): 75V; Temperature Coefficient: ±100ppm/℃; Operating Temperature Range: -55℃~+155℃
R17 = 0603WAF2001T5E: 电阻类型:厚膜电阻;阻值:2kΩ;精度:±1%;功率:100mW;最大工作电压:75V;温度系数:±100ppm/℃;; LCSC Part Name: 2kΩ ±1% 100mW 厚膜电阻; Supplier Part: C22975; Manufacturer: UNI-ROYAL(厚声); Supplier Footprint: 0603; Datasheet: https://atta.szlcsc.com/upload/public/pdf/source/20200306/C422600_1E6D84923E4A46A82E41ADD87F860B5C.pdf; Supplier: LCSC; Type: 厚膜电阻; Tolerance: ±1%; Power(Watts): 100mW; Overload Voltage (Max): 75V; Temperature Coefficient: ±100ppm/℃; Operating Temperature Range: -55℃~+155℃
R21 = 0603WAF5601T5E: 电阻类型:厚膜电阻;阻值:5.6kΩ;精度:±1%;功率:100mW;最大工作电压:75V;温度系数:±100ppm/℃;; LCSC Part Name: 5.6kΩ ±1% 100mW 厚膜电阻; Supplier Part: C23189; Manufacturer: UNI-ROYAL(厚声); Supplier Footprint: 0603; Datasheet: https://atta.szlcsc.com/upload/public/pdf/source/20200306/C422600_1E6D84923E4A46A82E41ADD87F860B5C.pdf; Supplier: LCSC; Type: 厚膜电阻; Tolerance: ±1%; Power(Watts): 100mW; Overload Voltage (Max): 75V; Temperature Coefficient: ±100ppm/℃; Operating Temperature Range: -55℃~+155℃
U5 = LM358ADR: 放大器数:双路;增益带宽积(GBP):700kHz;输入偏置电流(Ib):15nA;压摆率(SR):0.3V/us;带宽(-3db):-;; LCSC Part Name: 行业标准双路运算放大器; Supplier Part: C74525; Manufacturer: TI(德州仪器); Supplier Footprint: SOIC-8-150mil; Datasheet: https://www.ti.com/cn/lit/gpn/lm358a; Supplier: LCSC; Number of Circuits: 双路; Gain Bandwidth Product(GBP): 700kHz; Current - Input Bias(Ib): 15nA; Slew Rate(SR): 0.3V/us; Output Current: 40mA; Supply Current: 1mA; Operating Temperature: 0℃~+70℃

## Nets
GND: AMS1.1(GND) C1.1 C2.1 C3.1 C4.1 C5.1 C6.1 C7.1 C8.1 C9.1 C10.1 C11.1 C12.2 C13.1 C14.2 C15.1 C16.1 C17.1 FPC1.11 FPC1.18 H1.4 H2.10 H3.9 H5.8 H5.9 LED1.1(K) MIC1.2(GND) MX1.1(GND) MX1.5(GND) R8.2 R9.2 R11.1 R20.1 R22.1 SW1.1 U2.8(VSSA/VREF-) U2.23(VSS) U2.35(VSS) U2.47(VSS) U2.49(PAD) U3.2(S) U4.2(GND) U4.7(EP) U5.4(GND) USB1.4(ID) USB1.5(GND)
VBAT: R4.2 U2.1(VBAT)
VCC2V: R15.2 R18.2 U5.7(OUT2)
VCC3V3: AMS1.2(VOUT) C5.2 C6.2 C7.2 C8.2 C12.1 C15.2 C16.2 C17.2 FPC1.9 FPC1.10 H1.1 H3.10 H4.1 MX1.8(VIN) R1.2 R3.1 R4.1 R12.2 R13.2 R14.2 R19.2 R21.1 SW2.1(A) SW3.1(A) U1.2 U2.24(VDD) U2.36(VDD) U2.48(VDD) U4.5(VDD) U5.8(VCC)
VCC5V: AMS1.3(VIN) C14.1 H5.10 USB1.1(VBUS)
BOOT0: R8.1 SW2.4(D) U2.44(BOOT0)
CS: FPC1.14 H4.9 U2.14(PA4)
D/C: FPC1.15 H2.2 U2.26(PB13)
DATA: H3.6 R13.1 U2.43(PB7) U4.1(DATA)
LCD_LIGHT: H4.5 R10.2 U2.18(PB0)
LEDK1: FPC1.5 FPC1.6 FPC1.7 FPC1.8 U3.3(D)
LMOUT: H4.4 R16.2 U2.19(PB1) U5.1(OUT1)
MX_INT: H3.7 MX1.4(INT) U2.45(PB8)
MX_SCL: H4.2 MX1.6(SCL) U2.21(PB10)
MX_SDA: H3.8 MX1.7(SDA) U2.46(PB9)
NRST: C11.2 H5.4 R1.1 SW1.2 U2.7(NRST)
PA0: H5.3 U2.10(PA0)
PA1: H5.2 U2.11(PA1)
PA2: H5.1 U2.12(PA2)
PA3: H4.10 U2.13(PA3)
PA5: FPC1.16 H4.8 U2.15(PA5)
PA6: FPC1.12 H4.7 U2.16(PA6)
PA7: FPC1.13 H4.6 U2.17(PA7)
PA8: H2.5 U2.29(PA8)
PA9: H2.6 U2.30(PA9)
PA10: H2.7 U2.31(PA10)
PA11: H2.8 U2.32(PA11)
PA12: H2.9 U2.33(PA12)
PA15: H3.1 U2.38(PA15)
PB2: H4.3 R9.1 SW3.4(D) U2.20(PB2)
PB3: H3.2 U2.39(PB3)
PB4: H3.3 U2.40(PB4)
PB5: H3.4 U2.41(PB5)
PB6: H3.5 R14.1 U2.42(PB6) U4.6(SCK)
PB12: H2.1 U2.25(PB12)
PB14: FPC1.17 H2.3 R12.1 U2.27(PB14)
PB15: H2.4 U2.28(PB15)
PC13: H5.7 U2.2(PC13)
PC14/OSC32IN: C2.2 H5.6 U2.3(PC14/OSC32IN) X2.2
PC15/OSC32OUT: C4.2 H5.5 U2.4(PC15/OSC32OUT) X2.1
PH0-OSC_IN: C1.2 R2.2 U2.5(PH0-OSC_IN) X1.1(OSC1)
PH1-OSC_OUT: C3.2 R2.1 U2.6(PH1-OSC_OUT) X1.2(OSC2)
SWCLK: H1.3 U2.37(PA14)
SWDIO: H1.2 U2.34(PA13)
V_OUT: C18.2 R17.1
VCAP1: C13.2 U2.22(VCAP1)
VDDA/VREF+: C9.2 C10.2 U1.1 U2.9(VDDA/VREF+)
XL: FPC1.4
XR: FPC1.2
YD: FPC1.1
YU: FPC1.3
$1N3427: LED1.2(A) R3.2
$2N953: R10.1 R11.2 U3.1(G)
$5N355: C18.1 MIC1.1(OUT) R15.1
$5N1019: R16.1 R17.2 U5.2(IN1-)
$5N1201: R18.1 U5.6(IN2-)
$5N1377: R21.2 R22.2 U5.5(IN2+)
$5N1544: R19.1 R20.2 U5.3(IN1+)

Not connected (* = marked no-connect by the designer): AMS1 4(TAB)*; FPC1 19* 20*; MX1 2(RD)* 3(IRD)*; SW2 2(B)* 3(C)*; SW3 2(B)* 3(C)*; U4 3(NC)* 4(NC)*; USB1 2(D-)* 3(D+)* 6(SH1)* 7(SH2)* 8(SH3)* 9(SH4)*

## Notes on the sheets
sheet 1
- 电源指示灯
- 电源去耦
- ADC参考电压
- 晶振
- 复位
- 32.768应该是12pf
- st-link调试
- I2C2_SCL
- I2C2_SDA
- TIM3_CH3
- usb供电
- 备用电源vbat直连vcc
- BOOT
sheet 5
- 放大倍数,阻值根据实际调整
- 1/2偏置电压
- 分压电路，使其为2.0v

# Board PCB1
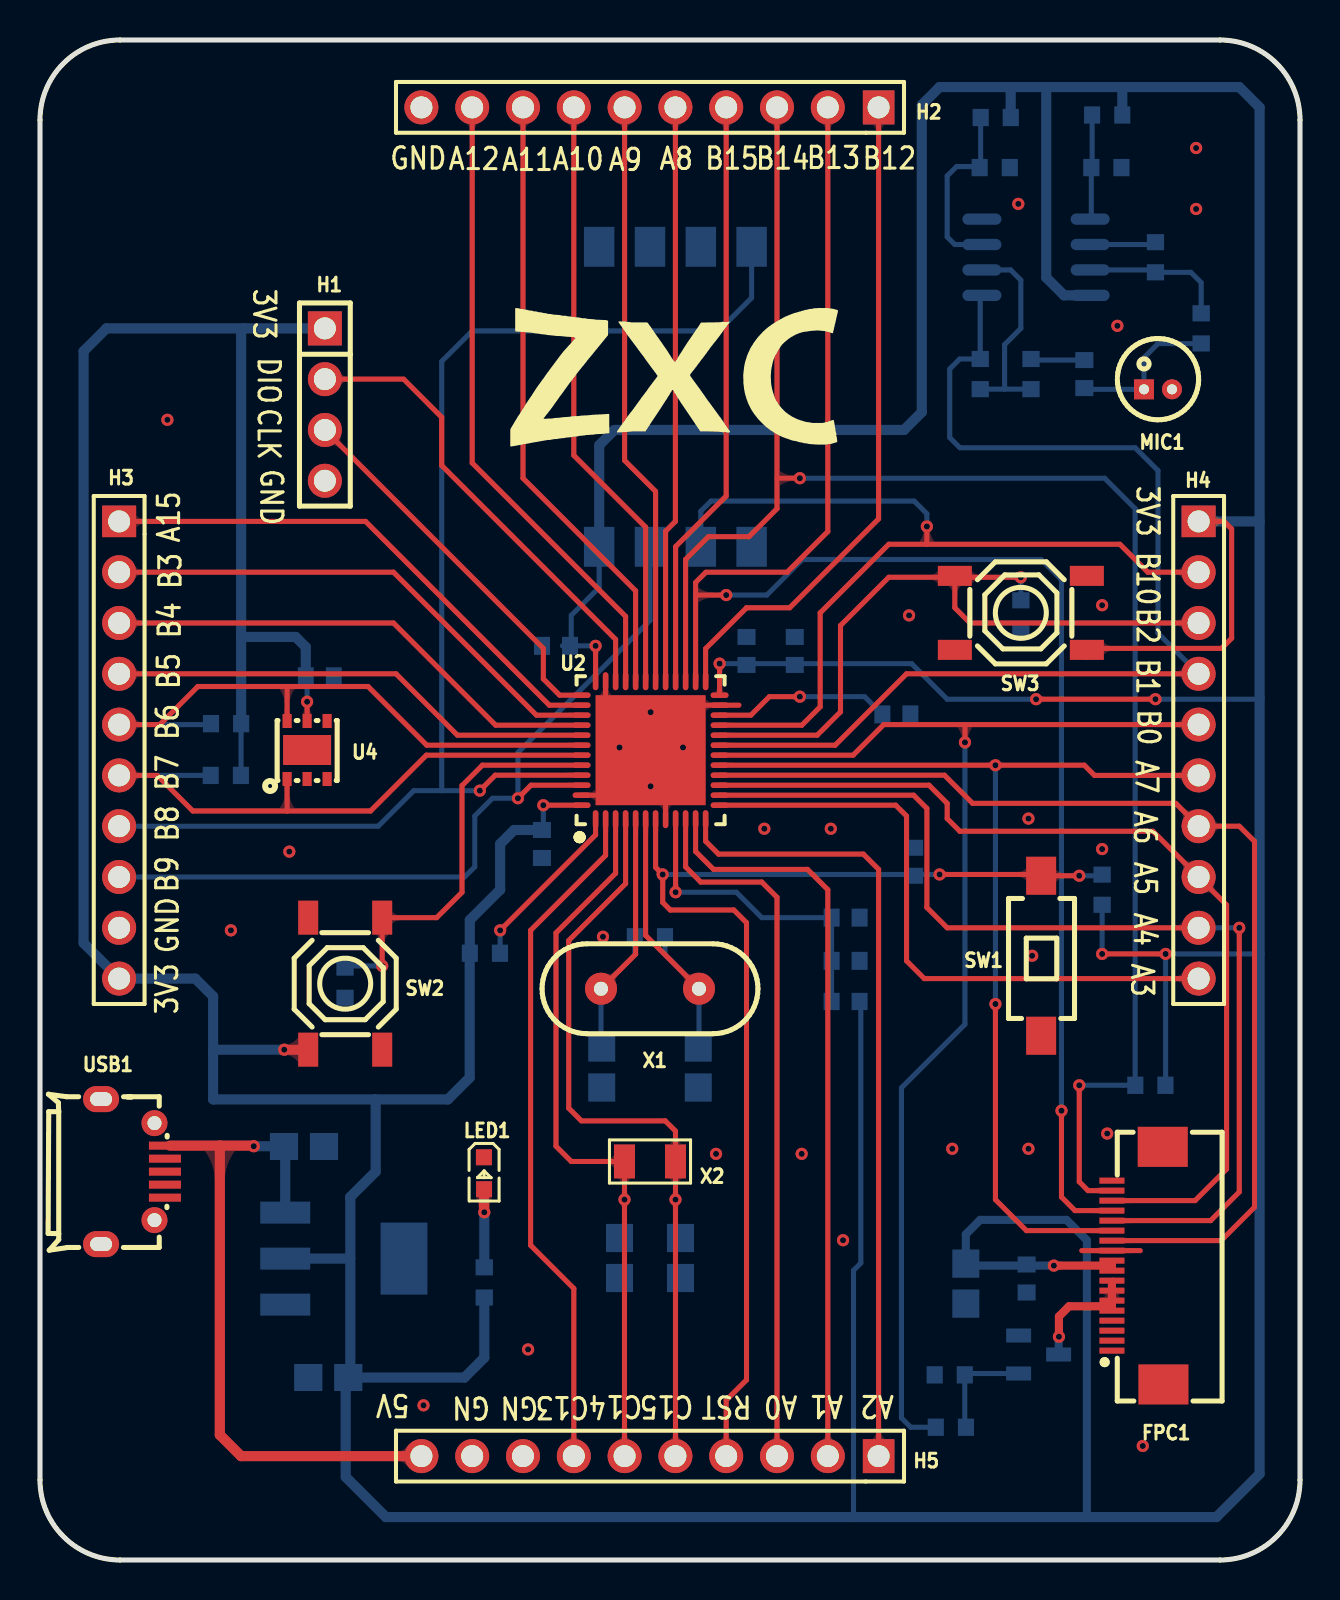
[diagram p5: board, top side]
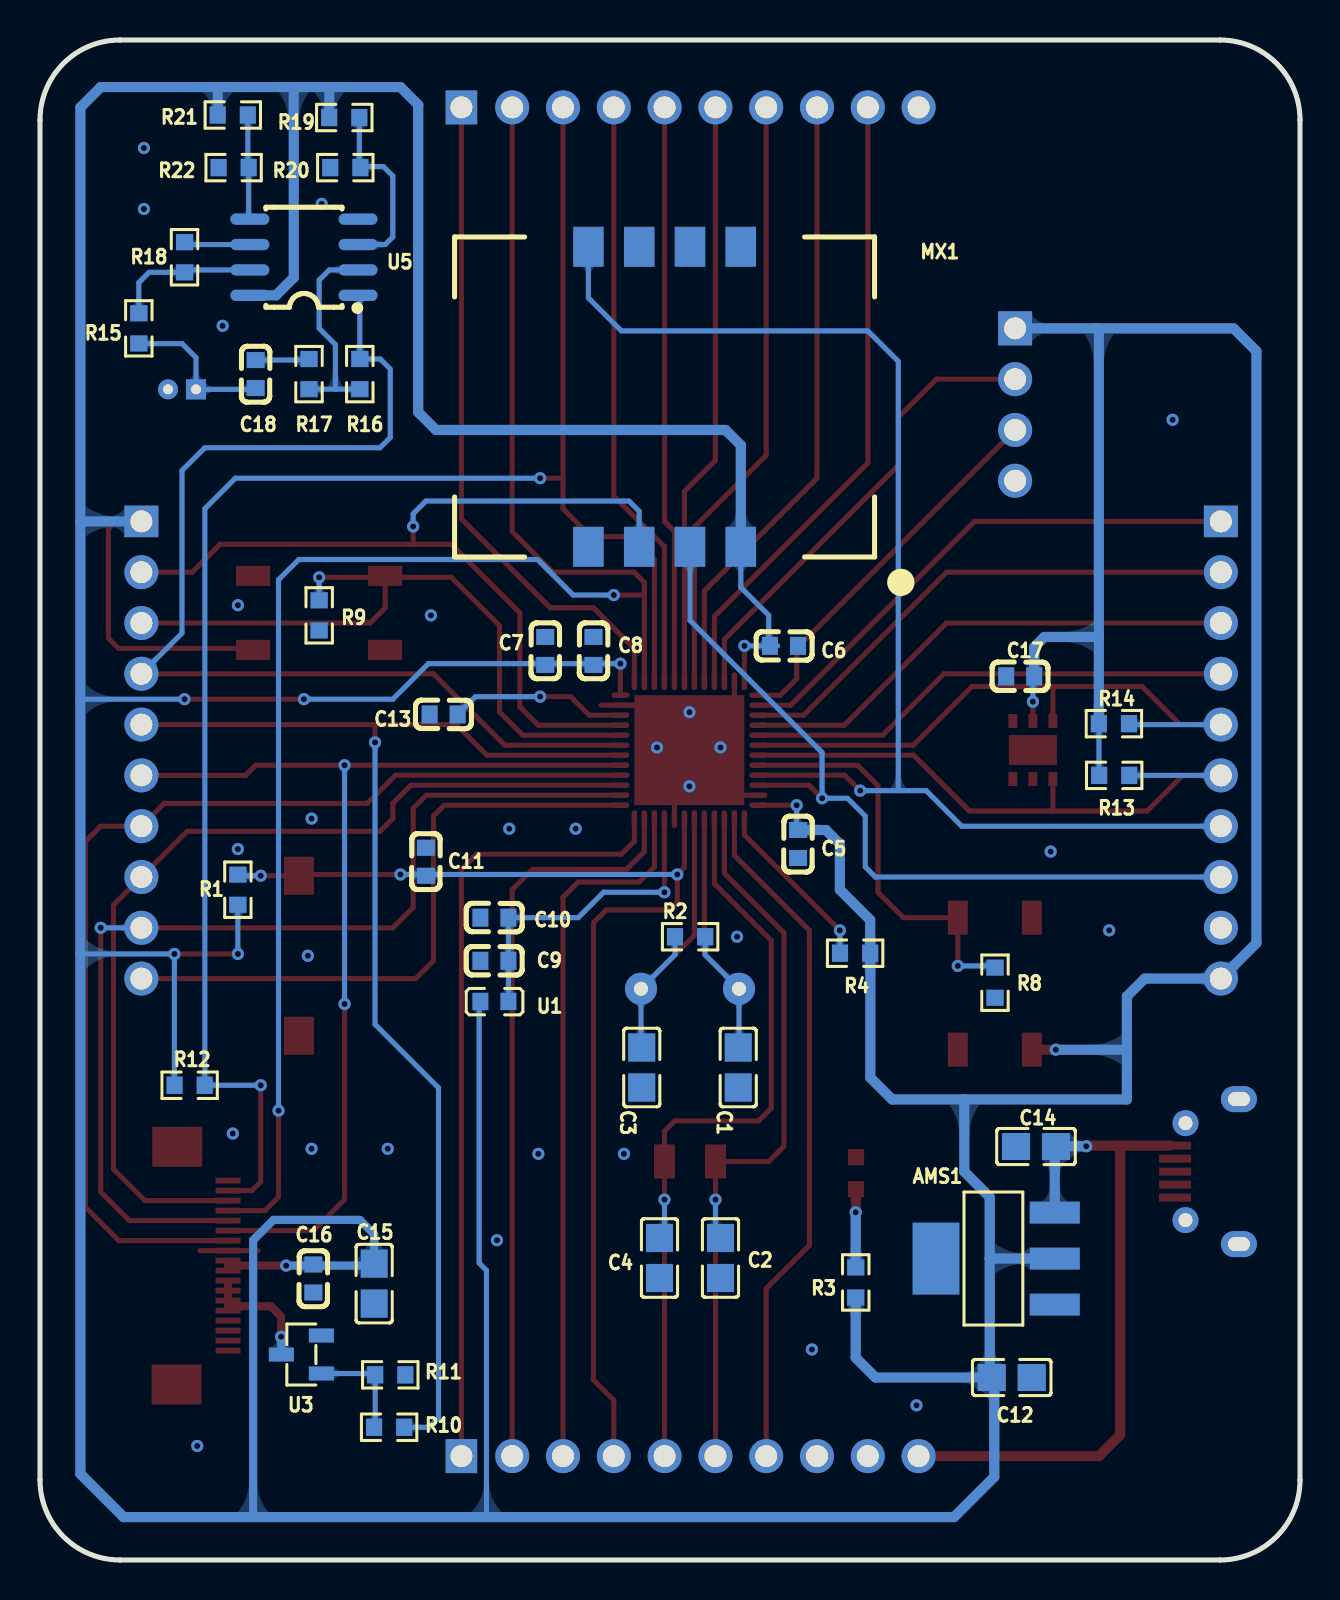
[diagram p6: board, bottom side, seen from below]

Outline 63 x 76 mm; copper layers: Top Layer, Bottom Layer. Coordinates in mm from the lower left corner of the outline.
Outline path: 0,72 0,4 arc(1.17,1.17) 4,0 59,0 arc(61.83,1.17) 63,4 63,72 arc(61.83,74.83) 59,76 4,76 arc(1.17,74.83) 0,72
Stack: Top Layer 0.035mm - / Dielectric1 1.51mm FR4 er 4.5 / Bottom Layer 0.035mm -

## Design rules (mm)
template: 自定义配置
spacing copperThickness1oz (default): track to track 0.102, other pairs 0.152 to 0.3
spacing copperThickness2oz: track to track 0.203, other pairs 0.152 to 0.3
track width copperThickness1oz (default): min 0.127, default 0.254, max 2.54
track width copperThickness2oz: min 0.203, default 0.254, max 2.54
differential pair differentialPair (default): width min 0.127, default 0.254, max 2.54; gap min 0.152, default 0.152
via viaSize (default): diameter min 0.5, default 0.61, max 10; hole min 0.3, default 0.305, max 6.3

## Placement (name value [footprint] x y rotation side)
AMS1  AMS1117-3.3  [SOT-223-3_L6.5-W3.5-P3.05-LS7.0]  15.23 15.07 180 bottom
C1  20pF  [C0805]  28.09 24.62 90 bottom
C2  20pF  [C0805]  28.98 15.1 90 bottom
C3  20pF  [C0805]  32.91 24.62 90 bottom
C4  20pF  [C0805]  32.02 15.1 90 bottom
C5  100nF  [C0603]  25.1 35.8 90 bottom
C6  100nF  [C0603]  25.8 45.71 0 bottom
C7  4.7uF  [C0603]  37.74 45.45 270 bottom
C8  100nF  [C0603]  35.33 45.45 270 bottom
C9  1uF  [C0603]  40.28 29.96 180 bottom
C10  10nF  [C0603]  40.28 32.12 180 bottom
C11  100nF  [C0603]  43.71 34.91 270 bottom
C12  10uF  [C0805]  14.41 9.12 180 bottom
C13  4.7uF  [C0603]  42.82 42.28 180 bottom
C14  10uF  [C0805]  13.2 20.67 0 bottom
C15  10uF  [C0805]  46.29 13.82 90 bottom
C16  100nF  [C0603]  49.33 14.07 90 bottom
C17  100nF  [C0603]  13.99 44.18 180 bottom
C18  1uF  [C0603]  52.22 59.3 90 bottom
FPC1  FPC-05F-18PH20  [FPC-SMD_18P-P0.50_FPC-05F-18PH20]  54.88 14.72 90 top
H1  PZ254V-11-04P  [HDR-TH_4P-P2.54-V-M]  14.24 57.77 270 top
H2  2.54-1*10P针  [HDR-TH_10P-P2.54-V-M-1]  30.5 72.63 180 top
H3  2.54-1*10P针  [HDR-TH_10P-P2.54-V-M-1]  3.96 40.5 270 top
H4  2.54-1*10P针  [HDR-TH_10P-P2.54-V-M-1]  57.93 40.5 270 top
H5  2.54-1*10P针  [HDR-TH_10P-P2.54-V-M-1]  30.5 5.19 180 top
LED1  NCD0603R1  [LED0603-RD_RED]  22.2 19.34 270 top
MIC1  B4012AP422-003  [MIC-TH_BD4.0-P1.40-D0.3-L]  55.9 58.53 180 top
MX1  -  [mx30102]  31.77 58.15 270 bottom
R1  10kΩ  [R0603]  53.11 33.52 270 bottom
R2  1mΩ  [R0603]  30.5 31.16 180 bottom
R3  4.7kΩ  [R0603]  22.21 13.88 90 bottom
R4  0Ω  [R0603]  22.25 30.34 0 bottom
R8  10kΩ  [R0603]  15.25 28.86 270 bottom
R9  10kΩ  [R0603]  49.04 47.23 270 bottom
R10  1kΩ  [R0603]  45.54 6.64 180 bottom
R11  10kΩ  [R0603]  45.49 9.26 0 bottom
R12  10kΩ  [R0603]  55.52 23.74 0 bottom
R13  4.7kΩ  [R0603]  9.29 39.23 0 bottom
R14  4.7kΩ  [R0603]  9.3 41.82 0 bottom
R15  2.2kΩ  [R0603]  58.06 61.58 90 bottom
R16  10kΩ  [R0603]  47.01 59.3 90 bottom
R17  2kΩ  [R0603]  49.55 59.3 270 bottom
R18  1kΩ  [R0603]  55.77 65.14 270 bottom
R19  10kΩ  [R0603]  47.79 72.12 0 bottom
R20  10kΩ  [R0603]  47.73 69.62 180 bottom
R21  5.6kΩ  [R0603]  53.36 72.25 180 bottom
R22  10kΩ  [R0603]  53.32 69.62 180 bottom
SW1  TS-1101-C-W  [SW-SMD_L6.0-W3.3-LS8.0]  50.06 30.21 90 top
SW2  TS-1187A-B-A-B  [SW-SMD_4P-L5.1-W5.1-P3.70-LS6.5-TL-2]  15.26 28.82 90 top
SW3  TS-1187A-B-A-B  [SW-SMD_4P-L5.1-W5.1-P3.70-LS6.5-TL-2]  49.04 47.36 180 top
U1  3.3uH  [L0603]  40.28 27.93 0 bottom
U2  STM32F411CEU6  [UFQFPN-48_L7.0-W7.0-P0.50-BL-EP]  30.53 40.49 0 top
U3  BSS138  [SOT-23-3_L2.9-W1.3-P1.90-LS2.4-BR]  49.93 10.27 180 bottom
U4  HTU21D  [DFN-6_L3.0-W3.0-P1.00-BL-EP]  13.35 40.5 0 top
U5  LM358ADR  [SOIC-8_L5.0-W4.0-P1.27-LS6.0-BL]  49.8 65.14 90 bottom
USB1  MicroXNJ  [MICRO-USB-SMD_MICROXNJ]  4.65 19.42 270 top
X1  8MHz  [OSC-TH_L10.0-W4.5-P5.00]  30.5 28.56 90 top
X2  32.768kHz  [OSC-SMD_L3.2-W1.5]  30.5 19.93 180 top

## Footprints (pads in the part's own frame, mm; a bottom-side part is the same pattern mirrored in y, then rotated)
C0603
  rect 0.8x0.9 smd: 1(-0.7,0) 2(0.7,0)
C0805
  rect 1.41x1.35 smd: 1(-1,0) 2(1,0)
DFN-6_L3.0-W3.0-P1.00-BL-EP
  rect 0.45x0.701 smd: 1(-1,-1.45) 2(0,-1.45) 3(1,-1.45) 4(1,1.45) 5(0,1.45) 6(-1,1.45)
  rect 2.4x1.5 smd: 7(0,0)
FPC-SMD_18P-P0.50_FPC-05F-18PH20
  rect 0.3x1.25 smd: 1(-4.25,1.288) 2(-3.75,1.288) 3(-3.25,1.288) 4(-2.75,1.288) 5(-2.25,1.288) 6(-1.75,1.288) 7(-1.25,1.288) 8(-0.75,1.288) 9(-0.25,1.288) 10(0.25,1.288) 11(0.75,1.288) 12(1.25,1.288) 13(1.75,1.288) 14(2.25,1.288) 15(2.75,1.288) 16(3.25,1.288) 17(3.75,1.288) 18(4.25,1.288)
  rect 2x2.5 smd: 19(-5.94,-1.288) 20(5.94,-1.252)
HDR-TH_4P-P2.54-V-M
  rect 1.7x1.7 hole 1.1: 1(-3.81,0)
  round 1.7 hole 1.1: 2(-1.27,0) 3(1.27,0) 4(3.81,0)
HDR-TH_10P-P2.54-V-M-1
  rect 1.575x1.7 hole 1.1: 1(-11.43,0)
  round 1.7 hole 1.1: 2(-8.89,0) 3(-6.35,0) 4(-3.81,0) 5(-1.27,0) 6(1.27,0) 7(3.81,0) 8(6.35,0) 9(8.89,0) 10(11.43,0)
L0603
  rect 0.8x0.864 smd: 1(-0.7,0) 2(0.7,0)
LED0603-RD_RED
  rect 0.8x0.8 smd: 1(-0.799,-0.004) 2(0.799,0.004)
MIC-TH_BD4.0-P1.40-D0.3-L
  rect 1x1 hole 0.5: 1(0.7,0)
  round 1 hole 0.5: 2(-0.7,0)
MICRO-USB-SMD_MICROXNJ
  rect 0.4x1.6 smd: 1(-1.3,1.597) 2(-0.65,1.597) 3(0,1.597) 4(0.65,1.597) 5(1.3,1.597)
  round 1.3 hole 0.7: 6(2.425,1.074) 9(-2.425,1.073)
  oval 1.3x1.8 hole 0.7x1.1: 7(3.625,-1.597) 8(-3.625,-1.597)
mx30102
  rect 2x1.524 smd: 1(-7.507,3.81) 2(-7.507,1.27) 3(-7.507,-1.27) 4(-7.507,-3.81) 5(7.493,-3.81) 6(7.493,-1.27) 7(7.493,1.27) 8(7.493,3.81)
OSC-SMD_L3.2-W1.5
  rect 1.05x1.7 smd: 1(-1.275,0) 2(1.275,0)
OSC-TH_L10.0-W4.5-P5.00
  round 1.6 hole 0.7: 1(0,2.45) 2(0,-2.45)
R0603
  rect 0.806x0.864 smd: 1(-0.753,0) 2(0.753,0)
SOIC-8_L5.0-W4.0-P1.27-LS6.0-BL
  oval 0.569x1.95 smd: 1(-1.905,-2.705) 2(-0.635,-2.705) 3(0.635,-2.705) 4(1.905,-2.705) 5(1.905,2.705) 6(0.635,2.705) 7(-0.635,2.705) 8(-1.905,2.705)
SOT-23-3_L2.9-W1.3-P1.90-LS2.4-BR
  rect 1.25x0.7 smd: 1(1,-0.95) 2(1,0.95) 3(-1,0)
SOT-223-3_L6.5-W3.5-P3.05-LS7.0
  rect 2.5x1.1 smd: 1(2.97,-2.3) 2(2.97,0) 3(2.97,2.3)
  rect 2.34x3.6 smd: 4(-2.97,0)
SW-SMD_4P-L5.1-W5.1-P3.70-LS6.5-TL-2
  rect 1.7x1 smd: 1(-3.3,1.85) 2(3.3,1.85) 3(-3.3,-1.85) 4(3.3,-1.85)
SW-SMD_L6.0-W3.3-LS8.0
  rect 1.9x1.5 smd: 1(-4,0) 2(4,0)
UFQFPN-48_L7.0-W7.0-P0.50-BL-EP
  oval 0.28x0.9 smd: 1(-2.751,-3.45) 2(-2.251,-3.45) 3(-1.75,-3.45) 4(-1.25,-3.45) 5(-0.749,-3.45) 6(-0.249,-3.45) 7(0.249,-3.45) 8(0.75,-3.45) 9(1.25,-3.45) 10(1.75,-3.45) 11(2.251,-3.45) 12(2.751,-3.45) 25(2.751,3.449) 26(2.251,3.449) 27(1.75,3.449) 28(1.25,3.449) 29(0.75,3.449) 30(0.249,3.449) 31(-0.249,3.449) 32(-0.749,3.449) 33(-1.25,3.449) 34(-1.75,3.449) 35(-2.251,3.449) 36(-2.751,3.449)
  oval 0.9x0.28 smd: 13(3.45,-2.751) 14(3.45,-2.251) 15(3.45,-1.75) 16(3.45,-1.25) 17(3.45,-0.75) 18(3.45,-0.249) 19(3.45,0.249) 20(3.45,0.749) 21(3.45,1.25) 22(3.45,1.75) 23(3.45,2.251) 24(3.45,2.751) 37(-3.449,2.751) 38(-3.449,2.251) 39(-3.449,1.75) 40(-3.449,1.25) 41(-3.449,0.749) 42(-3.449,0.249) 43(-3.449,-0.249) 44(-3.449,-0.75) 45(-3.449,-1.25) 46(-3.449,-1.75) 47(-3.449,-2.251) 48(-3.449,-2.751)
  rect 5.5x5.5 smd: 49(0,0)

## Nets
As in the schematic.

Pads without a net: AMS1 4; FPC1 19 20; MX1 2 3; SW2 2 3; SW3 2 3; U4 3 4; USB1 2 3 6 7 8 9

## Via types
v1: diameter 0.61, hole 0.305, Top Layer to Bottom Layer, 62 vias

## Routing (per net, layer and track width the routed paths; a pad name or vN(x,y) marks a point on that pad's centre or on a via; arc(x,y) is an arc through that point)
GND: length 10.2
  Top Layer w0.254: 52.09,15.47 FPC1.11 55.01,15.47 ; U2.8 31.28,39.74 ; 34.94,42.74 U2.23 32.78,42.74 ; U2.47 28.28,38.24 ; U2.35 28.28,42.74
  vias: v1(6.37,57.01) v1(9.54,31.48) v1(12.47,35.42) v1(19.18,7.73) v1(24.4,10.53) v1(28.15,31.16) v1(28.98,40.63) v1(30.53,42.39) v1(30.53,38.68) v1(32.15,40.63) v1(33.8,20.31) v1(36.22,36.56) v1(38.08,20.31) v1(39.54,36.56) v1(40.15,15.99) v1(43.45,47.23) v1(45.61,20.56) v1(48.91,67.81) v1(49.42,37.07) v1(49.42,20.56) v1(49.61,30.21) v1(53.11,47.74) v1(53.11,35.55) v1(53.36,21.32) v1(53.87,61.71) v1(55.14,5.7) v1(57.81,70.6) v1(57.81,67.55)
VBAT: length 8.7
  Top Layer w0.254: v1(23.01,31.48) 27.78,36.26 U2.1
  Bottom Layer w0.254: v1(23.01,31.48) 23.01,30.35 R4.2
VCC2V: length 7.5
  Bottom Layer w0.254: U5.7 55.65,64.5 R18.2 57.54,64.38 58.06,63.87 58.06,62.21
VCC3V3: length 468.3
  Top Layer w0.254: 52.34,45.13 52.79,45.58 59.07,45.58 59.58,46.09 59.58,51.55 59.2,51.93 H4.1 ; 53.6,14.59 FPC1.9 ; v1(13.35,42.91) U4.5 ; v1(49.8,43.04) v1(55.77,43.04) ; U2.36 v1(27.78,45.71) ; 27.08,37.74 v1(25.17,37.74) ; v1(56.28,30.3) v1(53.11,30.3) ; U2.24 v1(33.98,44.82)
  Top Layer w0.406: v1(50.69,14.72) 53.6,14.72 ; 53.6,14.72 53.6,14.84 ; 53.6,14.72 53.6,14.59
  Top Layer w0.508: v1(12.21,25.51) 13.41,25.51 SW2.1
  Bottom Layer w0.254: v1(25.17,37.74) 25.17,36.31 25.1,36.25 ; v1(49.8,43.04) 45.36,43.04 43.58,44.82 37.8,44.82 ; R12.2 56.28,23.74 v1(56.28,30.3) 60.97,30.3 60.98,30.29 ; v1(27.78,45.71) C6.2 ; C6.2 26.56,45.77 26.56,47.23 27.96,48.63 MX1.8 ; C6.2 26.12,45.71 ; v1(53.11,30.3) R1.2 ; 37.8,44.82 C7.2 ; 37.8,44.82 v1(33.98,44.82) ; 13.29,44.06 13.35,43.99 v1(13.35,42.91) ; 40.68,2.15 40.68,14.48 41.04,14.85 41.04,27.86 40.98,27.93 ; 10.06,41.82 10.05,41.81 10.05,39.24 R13.2 ; 60.98,43.06 60.96,43.04 v1(55.77,43.04)
  Bottom Layer w0.406: v1(50.69,14.72) 46.39,14.72 C15.2 46.29,16.29 47.01,17 51.33,17 52.34,15.99 52.34,2.15
  Bottom Layer w0.508: 54.11,73.65 59.96,73.65 60.98,72.63 60.98,51.93 ; 54.11,73.65 50.31,73.65 ; 54.11,73.65 R21.1 ; 15.29,9.12 15.29,4.15 17.29,2.15 58.82,2.15 60.98,4.31 60.98,51.93 ; 15.29,9.12 15.51,9.35 15.51,15.07 ; 15.29,9.12 21.22,9.12 22.21,10.12 R3.1 ; 15.51,15.07 AMS1.2 ; 15.51,15.07 15.51,18.15 16.78,19.42 16.78,23 16.76,23.03 ; 8.66,25.51 8.66,23.03 16.76,23.03 ; 8.66,25.51 v1(12.21,25.51) ; 8.66,25.51 8.66,28.18 7.77,29.07 H3.10 2.18,30.85 2.18,60.44 3.32,61.58 10.18,61.58 ; C5.2 23.71,36.5 23.01,35.8 23.01,33.52 21.49,32 R4.1 21.48,30.33 21.48,24.12 20.4,23.03 16.76,23.03 ; 60.98,51.93 H4.1 ; 50.31,73.65 50.31,64.12 51.2,63.23 U5.8 ; 50.31,73.65 48.53,73.65 ; R19.2 48.53,72.13 48.53,73.65 ; 48.53,73.65 44.98,73.65 44.09,72.76 44.09,57.39 43.2,56.5 28.72,56.5 27.96,55.74 MX1.8 ; 10.18,61.58 10.06,61.46 10.06,46.15 ; 10.18,61.58 H1.1 ; 10.06,46.15 12.78,46.15 13.29,45.64 C17.2 ; 10.06,46.15 10.06,41.82
VCC5V: length 34
  Top Layer w0.508: 8.99,20.72 8.99,6.26 10.05,5.19 H5.10 ; 8.99,20.72 10.66,20.72 v1(10.69,20.69) ; 8.99,20.72 6.5,20.72
  Bottom Layer w0.508: AMS1.3 12.26,20.61 C14.1 12.19,20.69 v1(10.69,20.69)
BOOT0: length 20.6
  Top Layer w0.254: U2.44 22.12,39.74 21.1,38.72 21.1,33.39 19.83,32.12 SW2.4 v1(17.11,29.7)
  Bottom Layer w0.254: R8.1 15.34,29.7 v1(17.11,29.7)
CS: length 51.8
  Top Layer w0.254: FPC1.14 58.53,16.97 59.96,18.4 v1(59.96,31.61) ; U2.14 43.68,38.24 44.34,37.58 44.34,32.63 45.36,31.61 H4.9
  Bottom Layer w0.254: v1(59.96,31.61) H4.9
D/C: length 86.9
  Top Layer w0.254: 32.78,48.24 32.78,48.88 33.29,49.39 37.36,49.39 39.39,51.42 H2.2 ; 32.78,48.24 U2.26 ; 32.78,48.24 32.79,48.25 v1(34.31,48.25) ; FPC1.15 51.75,17.47 51.07,18.15 v1(51.07,22.47)
  Bottom Layer w0.254: v1(34.31,48.25) 36.34,48.25 38.12,50.03 50.06,50.03 51.07,49.01 v1(51.07,22.47)
DATA: length 31.2
  Top Layer w0.254: 12.35,37.45 7.64,37.45 5.86,39.23 H3.6 ; 12.35,37.45 U4.1 ; 12.35,37.45 16.53,37.45 19.32,40.24 U2.43
  Bottom Layer w0.254: R13.1 H3.6
LCD_LIGHT: length 62.5
  Top Layer w0.254: U2.18 40.66,40.24 42.18,41.77 46.21,41.77 ; 46.21,41.77 46.25,41.73 v1(46.25,40.88) ; 46.21,41.77 H4.5
  Bottom Layer w0.254: v1(46.25,40.88) 46.25,26.78 43.07,23.61 43.07,7.1 43.53,6.64 44.79,6.64
LEDK1: length 6
  Top Layer w0.406: FPC1.6 FPC1.7 53.6,13.89 53.61,13.91 ; 53.6,12.69 53.6,12.56 ; 53.6,12.69 53.6,12.84 ; 53.6,12.69 51.46,12.69 50.95,12.18 v1(50.95,11.16)
  Bottom Layer w0.406: v1(50.95,11.16) 50.93,11.15 U3.3
LMOUT: length 55.9
  Top Layer w0.254: 33.98,40.74 39.76,40.74 43.33,44.31 H4.4
  Bottom Layer w0.254: H4.4 55.9,46.34 55.9,54.47 54.76,55.61 45.99,55.61 45.49,56.12 45.49,59.55 45.99,60.05 R16.2 47.01,63.15 U5.1
MX_INT: length 65
  Top Layer w0.254: v1(21.99,38.47) 22.76,39.24 U2.45
  Bottom Layer w0.254: 20.08,38.47 18.69,38.47 16.91,36.69 H3.7 ; 20.08,38.47 v1(21.99,38.47) ; 20.08,38.47 20.09,38.48 20.09,59.93 21.61,61.45 33.93,61.45 35.58,63.11 MX1.4
MX_SCL: length 46.1
  Top Layer w0.254: 44.33,50.79 42.44,50.79 39.01,47.36 39.01,42.66 38.09,41.74 U2.21 ; 44.33,50.79 44.34,50.8 v1(44.34,51.68) ; 44.33,50.79 54,50.79 55.39,49.39 H4.2
  Bottom Layer w0.254: v1(44.34,51.68) 44.34,52.31 43.71,52.95 33.55,52.95 33.04,52.44 MX1.6
MX_SDA: length 41.8
  Top Layer w0.254: U2.46 24.55,38.74 v1(23.9,38.09)
  Bottom Layer w0.254: MX1.7 30.5,46.98 23.9,40.37 v1(23.9,38.09) 22.63,38.09 21.74,37.2 21.74,34.66 21.23,34.15 H3.8
NRST: length 58
  Top Layer w0.254: v1(44.98,34.28) 49.99,34.28 SW1.2 v1(51.96,34.21) ; U2.7 30.78,34.63 v1(31.13,34.28) 31.13,32.88 31.52,32.5 34.69,32.5 35.33,31.86 35.33,9 34.31,7.99 H5.4
  Bottom Layer w0.254: v1(51.96,34.21) 53.05,34.21 R1.1 ; v1(44.98,34.28) v1(31.13,34.28)
PA0: length 35.5
  Top Layer w0.254: U2.10 32.28,34.66 33.04,33.9 36.09,33.9 36.85,33.13 H5.3
PA1: length 37.3
  Top Layer w0.254: H5.2 39.39,33.52 38.37,34.53 33.68,34.53 32.78,35.43 U2.11
PA2: length 39.7
  Top Layer w0.254: H5.1 41.93,34.53 41.17,35.29 33.93,35.29 33.28,35.94 U2.12
PA3: length 31.8
  Top Layer w0.254: H4.10 44.22,29.07 43.33,29.96 43.33,37.2 42.79,37.74 33.98,37.74
PA5: length 47.9
  Top Layer w0.254: U2.15 44.45,38.74 45.36,37.83 45.36,37.07 45.99,36.44 55.65,36.44 H4.8 59.33,32.75 59.33,19.55 57.75,17.97 FPC1.16
PA6: length 54.2
  Top Layer w0.254: U2.16 45.22,39.24 46.63,37.83 56.79,37.83 H4.7 59.96,36.69 60.73,35.93 60.73,17.64 59.06,15.97 FPC1.12
PA7: length 52.4
  Top Layer w0.254: v1(47.77,39.74) 47.8,39.74 47.8,39.74 ; 47.8,39.74 U2.17 ; 47.8,39.74 52.21,39.74 52.72,39.23 H4.6 ; v1(47.77,27.8) 47.77,18.02 49.32,16.47 FPC1.13
  Bottom Layer w0.254: v1(47.77,39.74) v1(47.77,27.8)
PA8: length 28.9
  Top Layer w0.254: H2.5 31.77,51.93 31.28,51.44 U2.29
PA9: length 29.3
  Top Layer w0.254: H2.6 29.23,54.98 30.78,53.43 U2.30
PA10: length 30.2
  Top Layer w0.254: U2.31 30.28,51.64 26.69,55.23 H2.7
PA11: length 31
  Top Layer w0.254: U2.32 29.78,48.46 24.15,54.09 H2.8
PA12: length 31.9
  Top Layer w0.254: H2.9 21.61,54.85 29.28,47.18 U2.33
PA15: length 26.9
  Top Layer w0.254: H3.1 16.28,51.93 25.47,42.74 U2.38
PB2: length 36.4
  Top Layer w0.254: 45.74,48.83 45.74,49.13 45.74,49.14 42.44,49.14 40.03,46.72 40.03,42.41 38.86,41.24 33.98,41.24 ; 45.74,48.83 45.74,47.61 46.5,46.85 H4.3 ; 45.74,48.83 46.05,49.14 v1(49.04,49.14)
  Bottom Layer w0.254: v1(49.04,49.14) 49.04,47.73
PB3: length 26.1
  Top Layer w0.254: U2.39 24.82,42.24 17.67,49.39 H3.2
PB4: length 25.2
  Top Layer w0.254: H3.3 17.67,46.85 22.78,41.74 U2.40
PB5: length 24.4
  Top Layer w0.254: H3.4 17.8,44.31 20.87,41.24 27.08,41.24
PB6: length 31.5
  Top Layer w0.254: U4.6 12.35,43.67 ; 27.08,40.74 19.34,40.74 16.4,43.67 7.89,43.67 5.99,41.77 H3.5
  Bottom Layer w0.254: H3.5 8.5,41.77 R14.1
PB12: length 33.5
  Top Layer w0.254: U2.25 33.28,45.57 35.33,47.61 37.49,47.61 41.93,52.06 H2.1
PB14: length 88.6
  Top Layer w0.254: U2.27 32.28,50.03 33.42,51.17 35.45,51.17 36.85,52.56 H2.3 ; FPC1.17 52.4,18.47 51.96,18.91 v1(51.96,23.74) ; v1(37.99,54.09) 36.85,54.09
  Bottom Layer w0.254: v1(51.96,23.74) 54.76,23.74 54.76,52.56 53.23,54.09 v1(37.99,54.09)
PB15: length 29.7
  Top Layer w0.254: H2.4 34.31,53.2 31.78,50.67 U2.28
PC13: length 34.3
  Top Layer w0.254: U2.2 28.28,35.23 24.53,31.48 24.53,15.73 26.69,13.58 H5.7
PC14/OSC32IN: length 38.1
  Top Layer w0.254: U2.3 28.78,34.33 25.8,31.36 25.8,20.69 26.56,19.93 X2.2 v1(29.22,18.02) 29.22,5.2 H5.6
  Bottom Layer w0.254: C2.2 29.22,16.35 v1(29.22,18.02)
PC15/OSC32OUT: length 39.7
  Top Layer w0.254: H5.5 31.78,5.2 v1(31.78,18.02) X2.1 31.78,21.44 31.26,21.96 27.07,21.96 26.44,22.59 26.44,30.97 29.28,33.82 U2.4
  Bottom Layer w0.254: C4.2 31.78,16.35 v1(31.78,18.02)
PH0-OSC_IN: length 15.4
  Top Layer w0.254: X1.1 29.78,30.29 U2.5
  Bottom Layer w0.254: R2.2 29.74,30.25 X1.1 28.05,25.66 C1.2
PH1-OSC_OUT: length 15.8
  Top Layer w0.254: X1.2 30.28,31.23 U2.6
  Bottom Layer w0.254: R2.1 31.25,30.26 X1.2 32.95,25.66 C3.2
SWCLK: length 19.2
  Top Layer w0.254: U2.37 25.98,43.24 25.17,44.06 25.17,45.58 H1.3
SWDIO: length 23.4
  Top Layer w0.254: H1.2 18.18,59.04 20.09,57.14 20.09,54.72 28.78,46.03 U2.34
V_OUT: length 2.8
  Bottom Layer w0.254: C18.2 49.48,60 49.42,60.05
VCAP1: length 8.9
  Top Layer w0.254: U2.22 35.54,42.24 36.47,43.17 v1(37.99,43.17)
  Bottom Layer w0.254: v1(37.99,43.17) 41.23,43.17 C13.2
VDDA/VREF+: length 16.2
  Top Layer w0.254: U2.9 v1(31.78,33.39)
  Bottom Layer w0.254: v1(31.78,33.39) 34.82,33.39 36.09,32.12 C10.2 C9.2 U1.1
$1N3427: length 3.9
  Top Layer w0.508: v1(22.21,17.39) 22.2,17.4 LED1.2
  Bottom Layer w0.508: v1(22.21,17.39) R3.2
$2N953: length 5.4
  Bottom Layer w0.254: R10.1 46.24,6.7 R11.2 46.31,9.32 U3.1
$5N355: length 7.8
  Bottom Layer w0.254: 58.06,60.7 57.94,60.82 55.9,60.82 55.2,60.12 MIC1.1 52.28,58.53 C18.1
$5N1019: length 10.4
  Bottom Layer w0.254: 48.23,58.54 R16.1 ; 48.23,58.54 49.42,58.54 ; 48.23,58.54 48.23,60.77 49.04,61.58 49.04,64 48.53,64.5 U5.2
$5N1201: length 3.3
  Bottom Layer w0.254: 52.51,65.77 55.65,65.77 R18.1
$5N1377: length 5.2
  Bottom Layer w0.254: U5.5 52.57,67.1 R22.2 52.61,69.66 R21.2
$5N1544: length 9.3
  Bottom Layer w0.254: 47.03,69.67 45.83,69.67 45.36,69.2 45.36,66.15 45.74,65.77 47.1,65.77 ; 47.03,69.67 R19.1 ; 47.03,69.67 R20.2

## Copper pours and planes (outline as drawn; the poured copper is in the pictures)
GND on Top Layer: -7.09,80.89 71.39,80.89 71.39,-7.63 -7.09,-7.63
GND on Bottom Layer: -5.06,83.55 67.2,83.55 67.2,-4.84 -5.06,-4.84

Small or netless copper shapes (teardrops, artwork), in the pictures only: 162 on Top Layer, 161 on Bottom Layer

## Text on the board
Top Silkscreen Layer: GND | A12 | A11 | A10 | A9 | A8 | B15 | B14 | B13 | B12 | 3V3 | B9 | B7 | B8 | B6 | B5 | A15 | B4 | B3 | 5V | GN | C13 | C14 | C15 | RST | A0 | A1 | A2 | DIO | CLK | A3 | A4 | A6 | A5 | A7 | B1 | B10 | B2 | B0
